# Altium project PCB.PrjPcb (part 6 of 8)

## Sheet FPGA_MISC.SchDoc
size 558 x 431 mm; SheetNumber: 8; SheetTotal: 25; Sheet_Name: FPGA MISCELLANEOUS; Size: 11x17
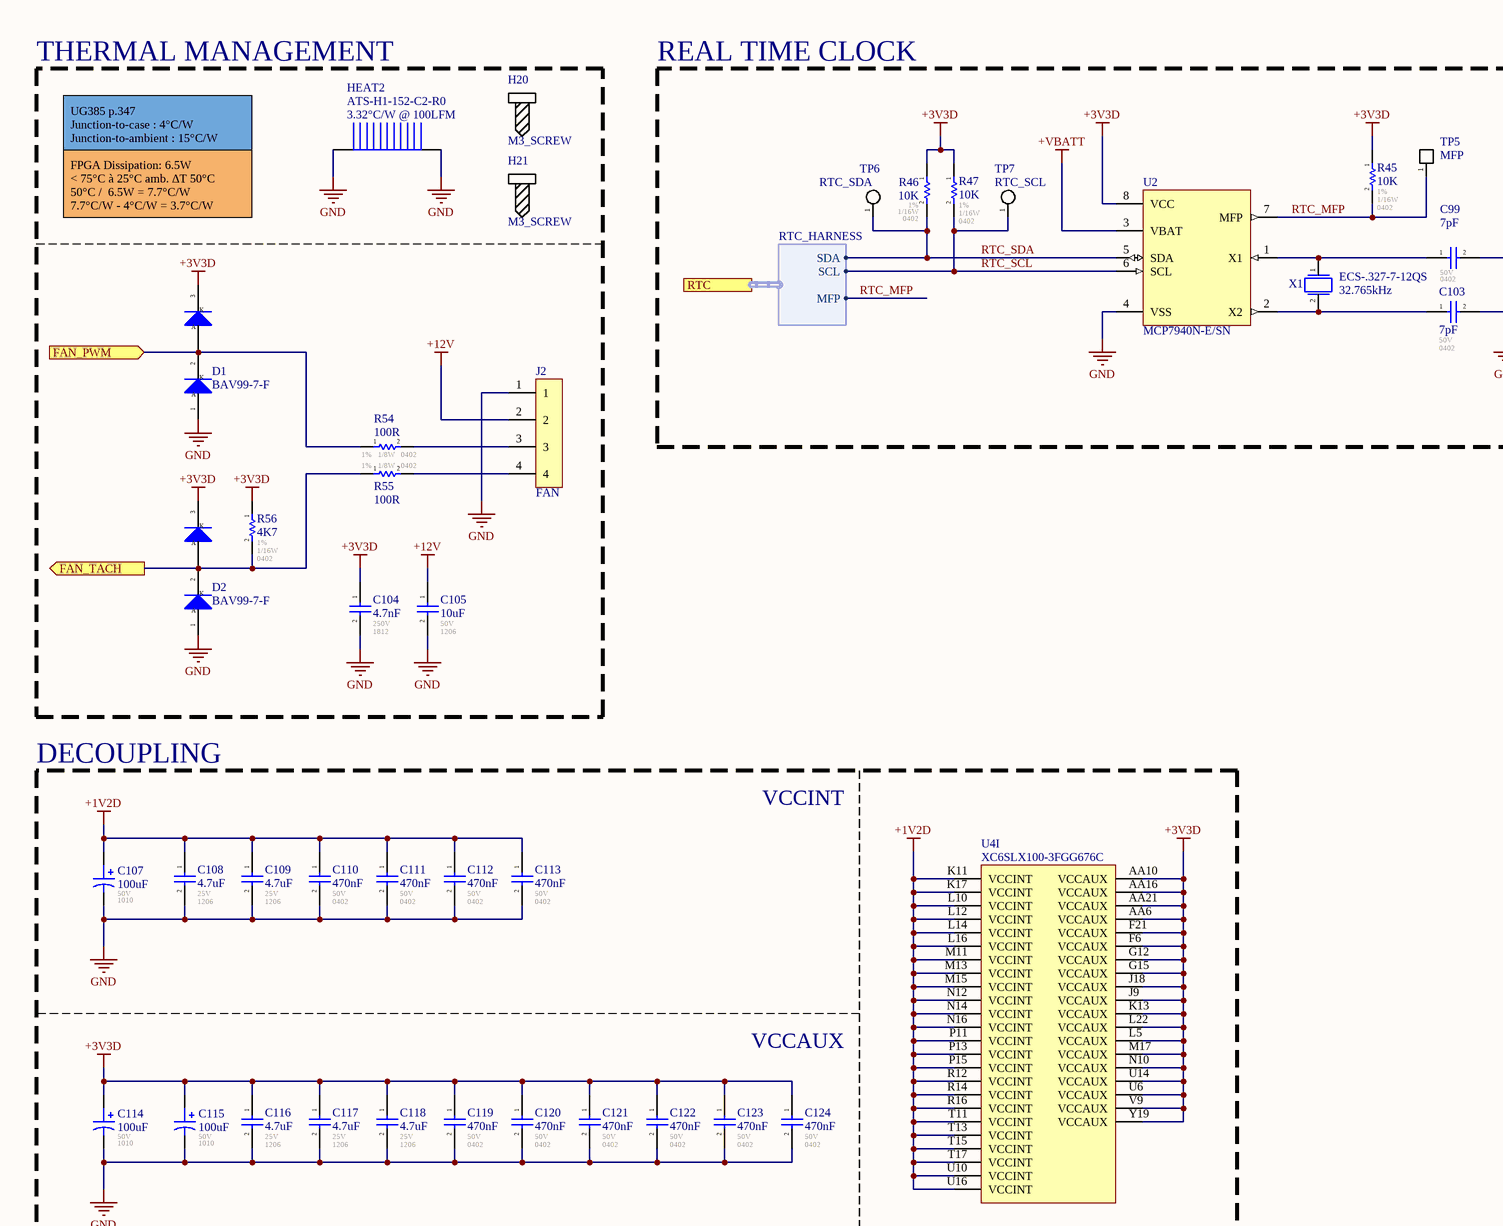
[diagram p32: FPGA_MISC.SchDoc, top left]
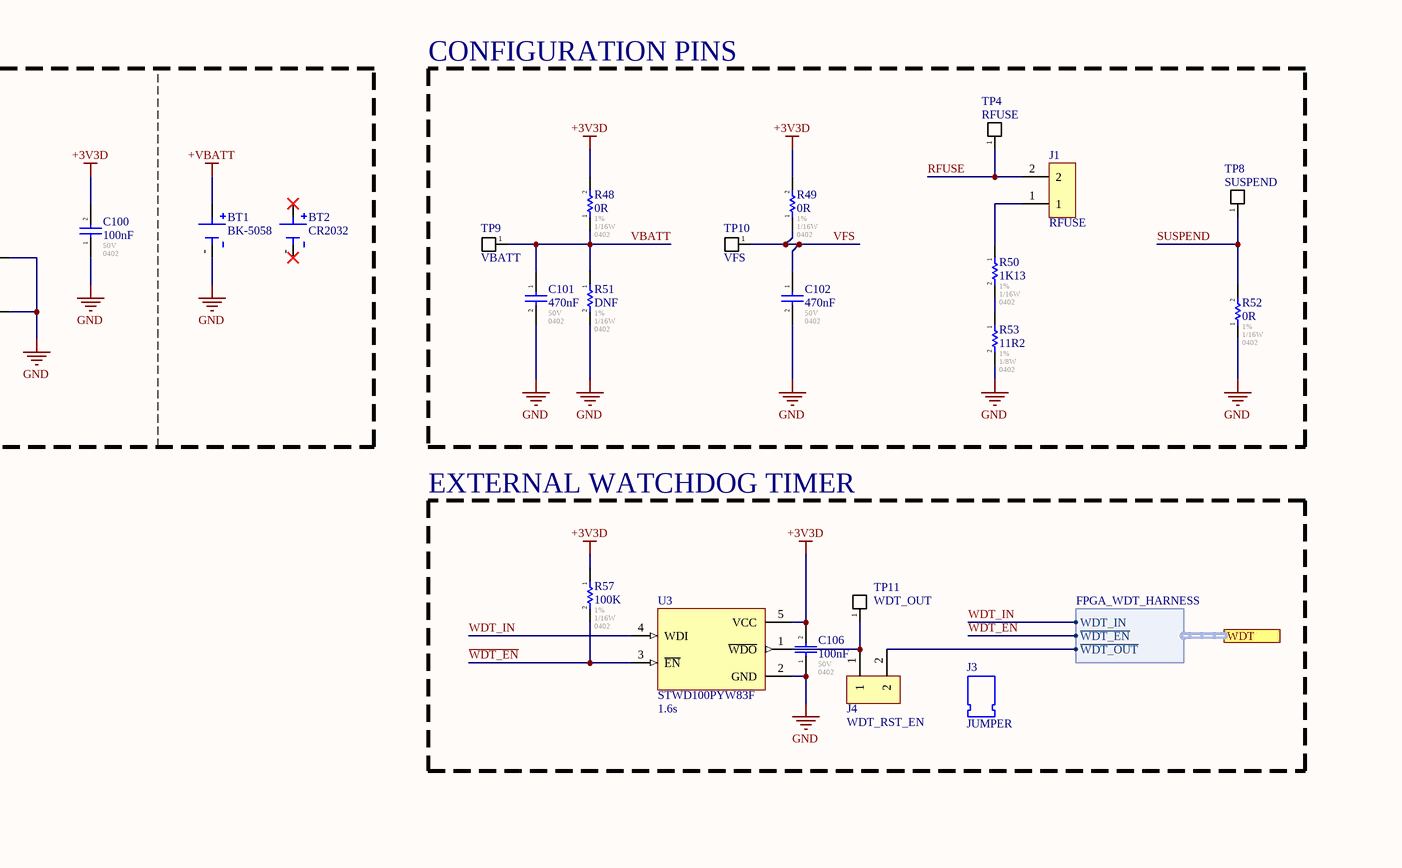
[diagram p33: FPGA_MISC.SchDoc, top right]
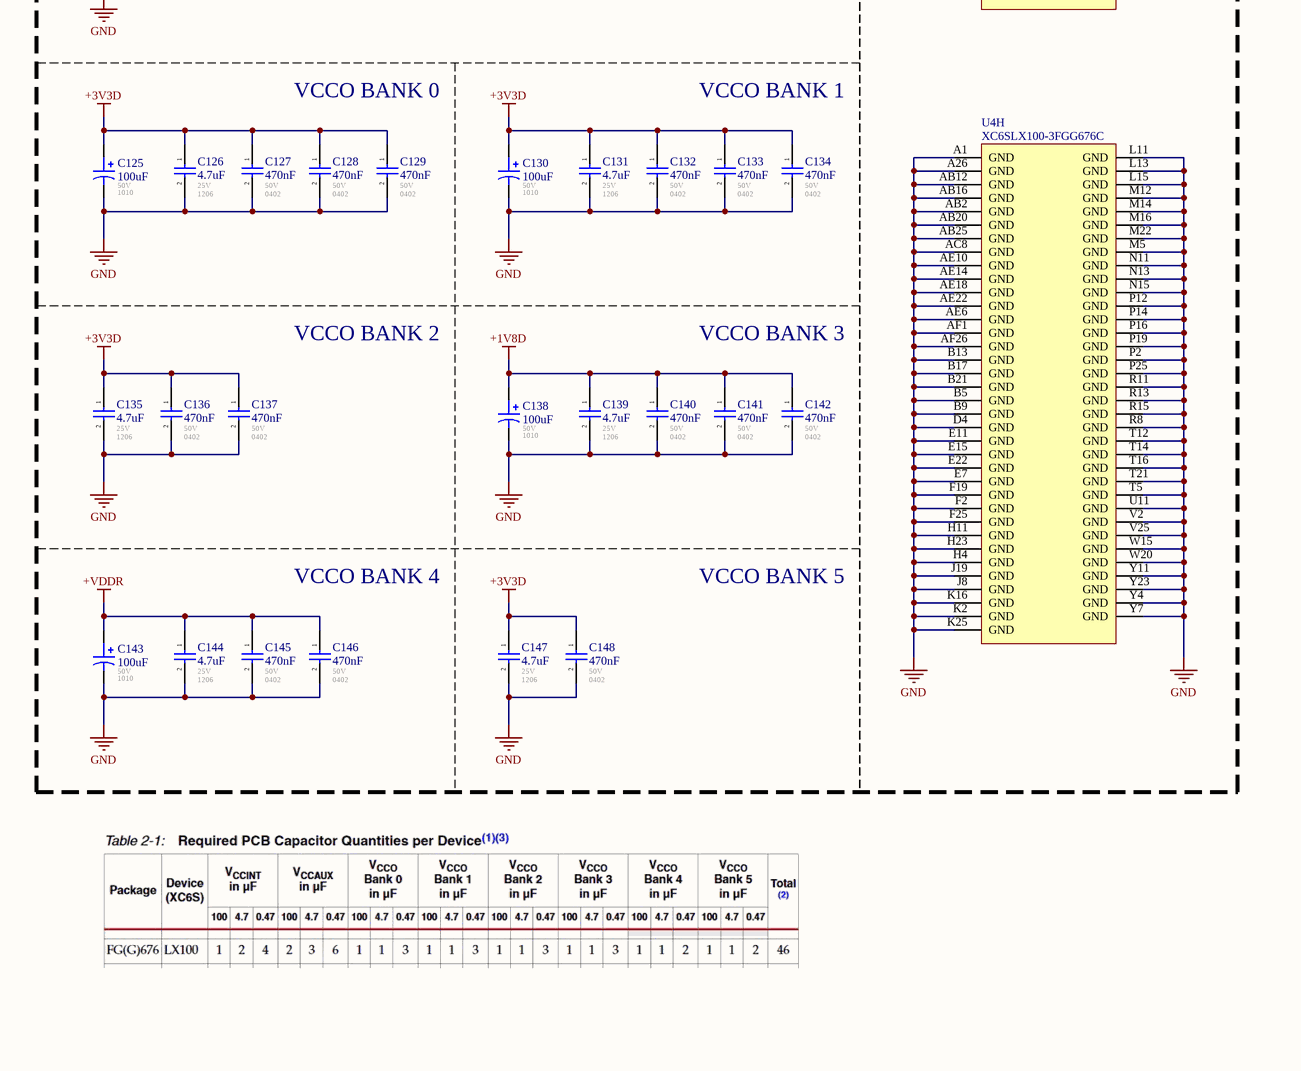
[diagram p34: FPGA_MISC.SchDoc, bottom left]
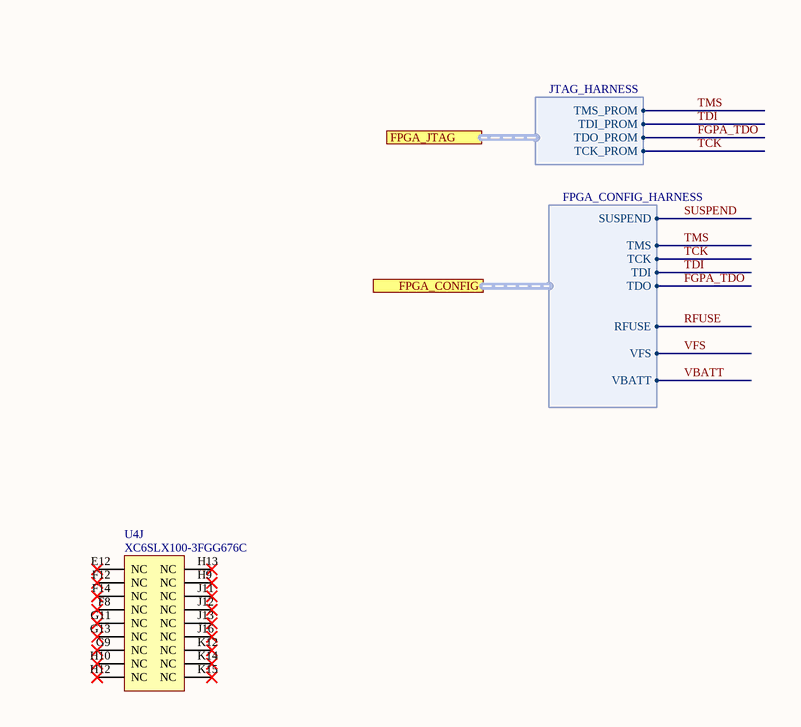
[diagram p35: FPGA_MISC.SchDoc, bottom right]

### Parts
BT1  BK-5058  [BK-5058]
BT2  CR2032  (mechanical)
C99  7pF  Voltage - Rated: 50V  Footprint: 0402  [CAP_0402]
C100  100nF  Voltage - Rated: 50V  Footprint: 0402  [CAP_0402]
C101  470nF  Voltage - Rated: 50V  Footprint: 0402  [CAP_0402]
C102  470nF  Voltage - Rated: 50V  Footprint: 0402  [CAP_0402]
C103  7pF  Voltage - Rated: 50V  Footprint: 0402  [CAP_0402]
C104  4.7nF  Voltage - Rated: 250V  Footprint: 1812  [CAP_1812]
C105  10uF  Voltage - Rated: 50V  Footprint: 1206  [CAP_1206]
C106  100nF  Voltage - Rated: 50V  Footprint: 0402  [CAP_0402]
C107  value 100uF  Voltage: 50V  Package: 1010  [CAP_ALU_1010_vishay]  (hidden comment: MAL215099101E3)
C108  4.7uF  Voltage - Rated: 25V  Footprint: 1206  [CAP_1206]
C109  4.7uF  Voltage - Rated: 25V  Footprint: 1206  [CAP_1206]
C110  470nF  Voltage - Rated: 50V  Footprint: 0402  [CAP_0402]
C111  470nF  Voltage - Rated: 50V  Footprint: 0402  [CAP_0402]
C112  470nF  Voltage - Rated: 50V  Footprint: 0402  [CAP_0402]
C113  470nF  Voltage - Rated: 50V  Footprint: 0402  [CAP_0402]
C114  value 100uF  Voltage: 50V  Package: 1010  [CAP_ALU_1010_vishay]  (hidden comment: MAL215099101E3)
C115  value 100uF  Voltage: 50V  Package: 1010  [CAP_ALU_1010_vishay]  (hidden comment: MAL215099101E3)
C116  4.7uF  Voltage - Rated: 25V  Footprint: 1206  [CAP_1206]
C117  4.7uF  Voltage - Rated: 25V  Footprint: 1206  [CAP_1206]
C118  4.7uF  Voltage - Rated: 25V  Footprint: 1206  [CAP_1206]
C119  470nF  Voltage - Rated: 50V  Footprint: 0402  [CAP_0402]
C120  470nF  Voltage - Rated: 50V  Footprint: 0402  [CAP_0402]
C121  470nF  Voltage - Rated: 50V  Footprint: 0402  [CAP_0402]
C122  470nF  Voltage - Rated: 50V  Footprint: 0402  [CAP_0402]
C123  470nF  Voltage - Rated: 50V  Footprint: 0402  [CAP_0402]
C124  470nF  Voltage - Rated: 50V  Footprint: 0402  [CAP_0402]
C125  value 100uF  Voltage: 50V  Package: 1010  [CAP_ALU_1010_vishay]  (hidden comment: MAL215099101E3)
C126  4.7uF  Voltage - Rated: 25V  Footprint: 1206  [CAP_1206]
C127  470nF  Voltage - Rated: 50V  Footprint: 0402  [CAP_0402]
C128  470nF  Voltage - Rated: 50V  Footprint: 0402  [CAP_0402]
C129  470nF  Voltage - Rated: 50V  Footprint: 0402  [CAP_0402]
C130  value 100uF  Voltage: 50V  Package: 1010  [CAP_ALU_1010_vishay]  (hidden comment: MAL215099101E3)
C131  4.7uF  Voltage - Rated: 25V  Footprint: 1206  [CAP_1206]
C132  470nF  Voltage - Rated: 50V  Footprint: 0402  [CAP_0402]
C133  470nF  Voltage - Rated: 50V  Footprint: 0402  [CAP_0402]
C134  470nF  Voltage - Rated: 50V  Footprint: 0402  [CAP_0402]
C135  4.7uF  Voltage - Rated: 25V  Footprint: 1206  [CAP_1206]
C136  470nF  Voltage - Rated: 50V  Footprint: 0402  [CAP_0402]
C137  470nF  Voltage - Rated: 50V  Footprint: 0402  [CAP_0402]
C138  value 100uF  Voltage: 50V  Package: 1010  [CAP_ALU_1010_vishay]  (hidden comment: MAL215099101E3)
C139  4.7uF  Voltage - Rated: 25V  Footprint: 1206  [CAP_1206]
C140  470nF  Voltage - Rated: 50V  Footprint: 0402  [CAP_0402]
C141  470nF  Voltage - Rated: 50V  Footprint: 0402  [CAP_0402]
C142  470nF  Voltage - Rated: 50V  Footprint: 0402  [CAP_0402]
C143  value 100uF  Voltage: 50V  Package: 1010  [CAP_ALU_1010_vishay]  (hidden comment: MAL215099101E3)
C144  4.7uF  Voltage - Rated: 25V  Footprint: 1206  [CAP_1206]
C145  470nF  Voltage - Rated: 50V  Footprint: 0402  [CAP_0402]
C146  470nF  Voltage - Rated: 50V  Footprint: 0402  [CAP_0402]
C147  4.7uF  Voltage - Rated: 25V  Footprint: 1206  [CAP_1206]
C148  470nF  Voltage - Rated: 50V  Footprint: 0402  [CAP_0402]
D1  BAV99-7-F  [SOT23-3]
D2  BAV99-7-F  [SOT23-3]
H20  M3_SCREW  (mechanical)
H21  M3_SCREW  (mechanical)
HEAT2  ATS-H1-152-C2-R0  Thermal Resistance: 3.32°C/W @ 100LFM  [ATS-H1-152-C2-R0]
J1  RFUSE  [HEADER-2_100MIL]
J2  FAN  [FAN_HEADER-4]
J3  JUMPER  (mechanical)
J4  WDT_RST_EN  [HEADER-2_100MIL]
R45  10K  Tolerance: 1%  Power: 1/16W  Package / Case: 0402  [RES_0402]
R46  10K  Tolerance: 1%  Power: 1/16W  Package / Case: 0402  [RES_0402]
R47  10K  Tolerance: 1%  Power: 1/16W  Package / Case: 0402  [RES_0402]
R48  0R  Tolerance: 1%  Power: 1/16W  Package / Case: 0402  [RES_0402]
R49  0R  Tolerance: 1%  Power: 1/16W  Package / Case: 0402  [RES_0402]
R50  1K13  Tolerance: 1%  Power: 1/16W  Package / Case: 0402  [RES_0402]
R51  DNF  Tolerance: 1%  Power: 1/16W  Package / Case: 0402  [RES_0402]
R52  0R  Tolerance: 1%  Power: 1/16W  Package / Case: 0402  [RES_0402]
R53  11R2  Tolerance: 1%  Power: 1/8W  Package / Case: 0402  [RES_0402]
R54  100R  Tolerance: 1%  Power: 1/8W  Package / Case: 0402  [RES_0402]
R55  100R  Tolerance: 1%  Power: 1/8W  Package / Case: 0402  [RES_0402]
R56  4K7  Tolerance: 1%  Power: 1/16W  Package / Case: 0402  [RES_0402]
R57  100K  Tolerance: 1%  Power: 1/16W  Package / Case: 0402  [RES_0402]
TP4  RFUSE  [TP_PAD]  (no BOM)
TP5  MFP  [TP_PAD]  (no BOM)
TP6  RTC_SDA  [TP_PAD_SMALL]  (no BOM)
TP7  RTC_SCL  [TP_PAD_SMALL]  (no BOM)
TP8  SUSPEND  [TP_PAD]  (no BOM)
TP9  VBATT  [TP_PAD]  (no BOM)
TP10  VFS  [TP_PAD]  (no BOM)
TP11  WDT_OUT  [TP_PAD]  (no BOM)
U2  MCP7940N-E/SN  [SOIC-8_3.8mm]
U3  STWD100PYW83F  Reset Timeout: 1.6s  [SOT23-5]
U4  XC6SLX100-3FGG676C  [FPGA_XILINX_FGG676]  (parts H,I,J of 10)
X1  ECS-.327-7-12QS  Frequency: 32.765kHz  [ECX-12Q-2MMx1.2MM]

### Blocks framed on the sheet
THERMAL MANAGEMENT: C104 C105 D1 D2 H20 H21 HEAT2 J2 R54-R56
REAL TIME CLOCK: BT1 BT2 C99 C100 C103 R45-R47 TP5-TP7 U2 X1
CONFIGURATION PINS: C101 C102 J1 R48-R53 TP4 TP8-TP10
EXTERNAL WATCHDOG TIMER: C106 J3 J4 R57 TP11 U3
DECOUPLING: C107-C148 U4

### Ports
FAN_PWM (in), FAN_TACH (out), FPGA_CONFIG (harness FPGA_CONFIG_HARNESS), FPGA_JTAG (harness JTAG_HARNESS), RTC (harness RTC_HARNESS), WDT (harness FPGA_WDT_HARNESS)

### Harnesses
FPGA_CONFIG_HARNESS: TCK, TDO, TDI, SUSPEND, TMS, RFUSE, VFS, VBATT
FPGA_WDT_HARNESS: WDT_IN, ~{WDT_EN}, ~{WDT_OUT}
JTAG_HARNESS: TCK_PROM, TDO_PROM, TDI_PROM, TMS_PROM
RTC_HARNESS: SDA, SCL, MFP

### Nets
+1V2D: C107.1 C108.1 C109.1 C110.1 C111.1 C112.1 C113.1 U4.K11(VCCINT) U4.K17(VCCINT) U4.L10(VCCINT) U4.L12(VCCINT) U4.L14(VCCINT) U4.L16(VCCINT) U4.M11(VCCINT) U4.M13(VCCINT) U4.M15(VCCINT) U4.N12(VCCINT) U4.N14(VCCINT) U4.N16(VCCINT) U4.P11(VCCINT) U4.P13(VCCINT) U4.P15(VCCINT) U4.R12(VCCINT) U4.R14(VCCINT) U4.R16(VCCINT) U4.T11(VCCINT) U4.T13(VCCINT) U4.T15(VCCINT) U4.T17(VCCINT) U4.U10(VCCINT) U4.U16(VCCINT)
+1V8D: C138.1 C139.1 C140.1 C141.1 C142.1
+3V3D: C100.2 C104.1 C106.2 C114.1 C115.1 C116.1 C117.1 C118.1 C119.1 C120.1 C121.1 C122.1 C123.1 C124.1 C125.1 C126.1 C127.1 C128.1 C129.1 C130.1 C131.1 C132.1 C133.1 C134.1 C135.1 C136.1 C137.1 C147.1 C148.1 D1.3(K) D2.3(K) R45.1 R46.1 R47.1 R48.2 R49.2 R56.1 R57.1 U2.8(VCC) U3.5(VCC) U4.AA6(VCCAUX) U4.AA10(VCCAUX) U4.AA16(VCCAUX) U4.AA21(VCCAUX) U4.F6(VCCAUX) U4.F21(VCCAUX) U4.G12(VCCAUX) U4.G15(VCCAUX) U4.J9(VCCAUX) U4.J18(VCCAUX) U4.K13(VCCAUX) U4.L5(VCCAUX) U4.L22(VCCAUX) U4.M17(VCCAUX) U4.N10(VCCAUX) U4.U6(VCCAUX) U4.U14(VCCAUX) U4.V9(VCCAUX) U4.Y19(VCCAUX)
+12V: C105.1 J2.2
+VBATT: BT1.+ U2.3(VBAT)
+VDDR: C143.1 C144.1 C145.1 C146.1
GND: BT1.- C99.2 C100.1 C101.2 C102.2 C103.2 C104.2 C105.2 C106.1 C107.2 C108.2 C109.2 C110.2 C111.2 C112.2 C113.2 C114.2 C115.2 C116.2 C117.2 C118.2 C119.2 C120.2 C121.2 C122.2 C123.2 C124.2 C125.2 C126.2 C127.2 C128.2 C129.2 C130.2 C131.2 C132.2 C133.2 C134.2 C135.2 C136.2 C137.2 C138.2 C139.2 C140.2 C141.2 C142.2 C143.2 C144.2 C145.2 C146.2 C147.2 C148.2 D1.1(A) D2.1(A) HEAT2.1 HEAT2.2 J2.1 R51.2 R52.1 R53.2 U2.4(VSS) U3.2(GND) U4.A1(GND) U4.A26(GND) U4.AB2(GND) U4.AB12(GND) U4.AB16(GND) U4.AB20(GND) U4.AB25(GND) U4.AC8(GND) U4.AE6(GND) U4.AE10(GND) U4.AE14(GND) U4.AE18(GND) U4.AE22(GND) U4.AF1(GND) U4.AF26(GND) U4.B5(GND) U4.B9(GND) U4.B13(GND) U4.B17(GND) U4.B21(GND) U4.D4(GND) U4.E7(GND) U4.E11(GND) U4.E15(GND) U4.E22(GND) U4.F2(GND) U4.F19(GND) U4.F25(GND) U4.H4(GND) U4.H11(GND) U4.H23(GND) U4.J8(GND) U4.J19(GND) U4.K2(GND) U4.K16(GND) U4.K25(GND) U4.L11(GND) U4.L13(GND) U4.L15(GND) U4.M5(GND) U4.M12(GND) U4.M14(GND) U4.M16(GND) U4.M22(GND) U4.N11(GND) U4.N13(GND) U4.N15(GND) U4.P2(GND) U4.P12(GND) U4.P14(GND) U4.P16(GND) U4.P19(GND) U4.P25(GND) U4.R8(GND) U4.R11(GND) U4.R13(GND) U4.R15(GND) U4.T5(GND) U4.T12(GND) U4.T14(GND) U4.T16(GND) U4.T21(GND) U4.U11(GND) U4.V2(GND) U4.V25(GND) U4.W15(GND) U4.W20(GND) U4.Y4(GND) U4.Y7(GND) U4.Y11(GND) U4.Y23(GND)
~{WDT_EN}: R57.2 U3.3(~{EN}) ; port WDT.~{WDT_EN}
FAN_PWM: D1.2(K) R54.1 ; port FAN_PWM
FAN_TACH: D2.2(K) R55.1 R56.2 ; port FAN_TACH
FGPA_TDO: port FPGA_CONFIG.TDO, port FPGA_JTAG.TDO_PROM
RFUSE: J1.2 TP4.1(A) ; port FPGA_CONFIG.RFUSE
RTC_MFP: R45.2 TP5.1(A) U2.7(MFP) ; port RTC.MFP
RTC_SCL: R47.2 TP7.1(A) U2.6(SCL) ; port RTC.SCL
RTC_SDA: R46.2 TP6.1(A) U2.5(SDA) ; port RTC.SDA
SUSPEND: R52.2 TP8.1(A) ; port FPGA_CONFIG.SUSPEND
TCK: port FPGA_CONFIG.TCK, port FPGA_JTAG.TCK_PROM
TDI: port FPGA_CONFIG.TDI, port FPGA_JTAG.TDI_PROM
TMS: port FPGA_CONFIG.TMS, port FPGA_JTAG.TMS_PROM
VBATT: C101.1 R48.1 R51.1 TP9.1(A) ; port FPGA_CONFIG.VBATT
VFS: C102.1 R49.1 TP10.1(A) ; port FPGA_CONFIG.VFS
WDT_IN: U3.4(WDI) ; port WDT.WDT_IN
WDTO: J4.2 ; port WDT.~{WDT_OUT}
NetC99_1: C99.1 U2.1(X1) X1.1
NetC103_1: C103.1 U2.2(X2) X1.2
NetJ1_1: J1.1 R50.1
NetJ2_3: J2.3 R54.2
NetJ2_4: J2.4 R55.2
NetJ4_1: J4.1 TP11.1(A) U3.1(~{WDO})
NetR50_2: R50.2 R53.1

Not connected (* = marked no-connect by the designer): BT2 +* -*; U4 E12(NC)* F8(NC)* F12(NC)* F14(NC)* G9(NC)* G11(NC)* G13(NC)* H9(NC)* H10(NC)* H12(NC)* H13(NC)* J11(NC)* J12(NC)* J13(NC)* J16(NC)* K12(NC)* K14(NC)* K15(NC)*

### Notes on the sheet
- UG385 p.347
  Junction-to-case : 4°C/W
  Junction-to-ambient : 15°C/W
- FPGA Dissipation: 6.5W
  < 75°C à 25°C amb. ΔT 50°C
  50°C /  6.5W = 7.7°C/W
  7.7°C/W - 4°C/W = 3.7°C/W
- VCCINT
- VCCAUX
- VCCO BANK 0
- VCCO BANK 1
- VCCO BANK 2
- VCCO BANK 3
- VCCO BANK 4
- VCCO BANK 5
- Sheet Name
- Project Title
- Global Project
- Revision
- Size
- Date
- Group
- Sheet
- of
- Filename
- Designers

### Library data of the parts
BT1 = BATTERY: Battery Holder; Mfr: MPD; ComponentLink1Description: Digikey; ComponentLink1URL: https://www.digikey.com/en/products/detail/mpd-memory-protection-devices/BK-5058/2194769
BT2 = BATTERY: Mfr: *; Size: *; Capacity: *; Voltage - Max: *; Voltage - Nominal: *; Voltage - Min: *; Current - Max: *
C99 C103 = CAP_CER: 0402 7pF C0G Ceramic Capacitor / GCM1555C1H7R0BA16D; Mfr: Murata; Operating Temperature: -55C - 125C; Temperature Coefficient: C0G; ComponentLink1Description: Digikey; ComponentLink1URL: https://www.digikey.ca/en/products/detail/murata-electronics/GCM1555C1H7R0BA16D/11618476; ComponentLink2Description: Datasheet; ComponentLink2URL: https://search.murata.co.jp/Ceramy/image/img/A01X/G101/ENG/GCM1555C1H7R0BA16-01.pdf
C100 C106 = CAP_CER: GCM155R71H104KE02J / 0402 100nF 10% X7R Ceramic Capacitor; Mfr: Murata; Operating Temperature: -55C - 125C; Temperature Coefficient: X7R; ComponentLink1Description: Digikey; ComponentLink1URL: [Digikey Link]; Part#: GCM155R71H104KE02J; ComponentLink2Description: Datasheet; ComponentLink2URL: [Datasheet Link]; Tolerance: 10%; Ratings: AEC-Q200
C101 C102 C110-C113 C119-C124 C127-C129 C132-C134 C136 C137 C140-C142 C145 C146 C148 = CAP_CER: CGA3E3X7R1H474K080AB / 0603 470nF 10% X7R Ceramic Capacitor; Mfr: TDK; Operating Temperature: -55C - 125C; Temperature Coefficient: X7R; ComponentLink1Description: Digikey; ComponentLink1URL: [Digikey Link]; Part#: CGA3E3X7R1H474K080AB; ComponentLink2Description: Datasheet; ComponentLink2URL: [Datasheet Link]; Tolerance: 10%; Ratings: AEC-Q200
C104 = CAP_CER: GA343DR7GD472KW01L / 0402 4.7nF 10% X7R 1812 250VAC Ceramic Capacitor; Mfr: Murata; Ratings: Y3 - Safety; Operating Temperature: -55C - 125C; Temperature Coefficient: X7R; ComponentLink1Description: Digikey; ComponentLink1URL: https://www.digikey.ca/en/products/detail/murata-electronics/GA343DR7GD472KW01L/789292; ComponentLink2Description: Datasheet; ComponentLink2URL: https://search.murata.co.jp/Ceramy/image/img/A01X/G101/ENG/GA343DR7GD472KW01-01.pdf; ComponentLink3Description: Octopart; ComponentLink3URL: https://octopart.com/ga343dr7gd472kw01l-murata-197048?r=sp; Tolerance: 10%; Part#: GA343DR7GD472KW01L; ComponentLink4Description: Murata; ComponentLink4URL: https://www.murata.com/en-us/products/productdetail?partno=GA343DR7GD472KW01%23
C105 = CAP_CER: GRT31CR61H106KE01L / 1206 10uF 10% X5R Ceramic Capacitor; Mfr: Murata; Operating Temperature: -55C - 85C; Temperature Coefficient: X5R; ComponentLink1Description: Digikey; ComponentLink1URL: [Digikey Link]; ComponentLink2Description: Datasheet; ComponentLink2URL: [Datasheet Link]; Tolerance: 10%; Ratings: AEC-Q200; Supplier 1: Arrow Electronics; Supplier Part Number 1: GRT31CR61H106KE01L; Part#: GRT31CR61H106KE01L
C107 C114 C115 C125 C130 C138 C143 = CAP_ALU_MAL215099101E3: CAP - ALU 100uF 20% 50V - 1010; Current: 490mA; Mfg: Vishay Dale; Mfg Part Number: MAL215099101E3; HelpURL: http://www.vishay.com/docs/28395/150crz.pdf; CreatedBy: Jonathan Bouchard; Temperature: -55°C to 125°C; Power: *; Supplier 1: Digikey; Supplier Part Number 1: 4399PHDKR-ND; Precision: 20%
C108 C109 C116-C118 C126 C131 C135 C139 C144 C147 = CAP_CER: CGA8L2X7R1E475M160KA / 1812 4.7uF 20% X7R Ceramic Capacitor; Mfr: TDK; Part#: CGA9N1X7R1V476M230KC; Operating Temperature: -55C - 125C; Temperature Coefficient: X7R; ComponentLink1Description: Digikey; ComponentLink1URL: https://www.digikey.ca/en/products/detail/tdk-corporation/CGA9N1X7R1V476M230KC/15930202; ComponentLink2Description: Datasheet; ComponentLink2URL: https://product.tdk.com/system/files/dam/doc/product/capacitor/ceramic/mlcc/catalog/mlcc_automotive_general_en.pdf; Tolerance: 20%; Ratings: AEC-Q200; ComponentLink3Description: TDK; ComponentLink3URL: https://product.tdk.com/en/search/capacitor/ceramic/mlcc/info?part_no=CGA9N1X7R1V476M230KC; ComponentLink4Description: Octopart; ComponentLink4URL: https://octopart.com/cga9n1x7r1v476m230kc-tdk-122377816?r=sp; Supplier 1: Newark; Supplier Part Number 1: 57AK9414
D1 D2 = DIODE_TVS_DUAL: Diode Array 1 Pair Series Connection 75 V 300mA (DC) Surface Mount TO-236-3, SC-59, SOT-23-3; Mfr: Diodes Incorporated; Voltage - DC Reverse: 75V; Voltage - Forward: 1.25V @ 150mA; Reverse Recovery Time: 4ns; Capacitance: 2pF; Current - Reverse Leakage: 2.5µA @ 75V; Operating Temperature: -65C - 150C; Package / Case: SOT-23-3; Current: 300mA; ComponentLink1Description: Digikey; ComponentLink1URL: https://www.digikey.ca/en/products/detail/diodes-incorporated/BAV99-7-F/815018; ComponentLink2Description: Datasheet; ComponentLink2URL: https://www.diodes.com/assets/Datasheets/BAV99.pdf; ComponentLink3Description: Octopart; ComponentLink3URL: https://octopart.com/bav99-7-f-diodes+inc.-326328; Supplier 1: Future Electronics; Supplier Part Number 1: 3851920
HEAT2 = HEATSINK_ATS-H1-152-C2-R0: Heatsink Aluminium; Mfr: Advanced Thermal Solutions Inc.; Hole Size: 3mm; Hole-to-hole: 56,5685mm; Fin Height: 35mm; Length: 35; Width: 35; Material: Aluminium; ComponentLink1Description: Digikey; ComponentLink1URL: https://www.digikey.com/en/products/detail/advanced-thermal-solutions-inc/ATS-H1-152-C2-R0/4624447; Supplier 1: Digikey; Supplier Part Number 1: ATS36354-ND; ComponentLink2Description: Mfr; ComponentLink2URL: https://www.qats.com/Online-PushPin/ATS-H1-152-C2-R0
J1 J4 = HEADER_2
J2 = HEADER_4
R45-R57 = RESISTOR: Automotive: AEC-Q200; Operating Temperature: *; # Digikey: *; ComponentLink1Description: Digikey; ComponentLink1URL: *; # Manufacturer: *
TP4 TP5 TP8-TP11 = TESTPOINT_PAD: Test Point
TP6 TP7 = TESTPOINT_PAD_SMALL: Test Point
U2 = MCP7940N-E/SN: Real Time Clock (RTC) IC Clock/Calendar 64B I2C, 2-Wire Serial 8-SOIC (0.154", 3.90mm Width); Mfr: Microchip; Qualification: AEC-Q100; Voltage - Suply: 1.8V - 5.5V; Voltage - Battery: 1.3V - 5.5V; Clock Speed: 32.768kHz; Operating Temperature: -40C - 125C; ComponentLink1Description: Digikey; ComponentLink1URL: https://www.digikey.ca/en/products/detail/microchip-technology/MCP7940N-E-SN/3872278; ComponentLink2Description: Datasheet; ComponentLink2URL: https://ww1.microchip.com/downloads/aemDocuments/documents/MPD/ProductDocuments/DataSheets/MCP7940N-Battery-Backed-I2C-RTCC-with-SRAM-20005010J.pdf; ComponentLink3Description: Mfr; ComponentLink3URL: https://www.microchip.com/en-us/product/MCP7940N; ComponentLink4Description: Octopart; ComponentLink4URL: https://octopart.com/mcp7940n-e%2Fsn-microchip-24995176?r=sp
U3 = STWD100PYW83F: WATCHDOG CIRCUIT / IC SUPERVISOR 1 CHANNEL SOT23-5; Mfr: ST; Qualification: AEC-Q100; ComponentLink1Description: Digikey; ComponentLink1URL: https://www.digikey.ca/en/products/detail/stmicroelectronics/STWD100PYW83F/3711383; ComponentLink2Description: Datasheet; ComponentLink2URL: https://www.st.com/content/ccc/resource/technical/document/datasheet/06/6a/b3/83/9a/c7/4f/22/CD00176077.pdf/files/CD00176077.pdf/jcr:content/translations/en.CD00176077.pdf; Supplier 1: Mouser; Supplier Part Number 1: 511-STWD100PYW83F
U4 = FPGA_XC6SLX100-3FGG676C: FPGA - XILINX SPARTAN 6 480 I/O - BGA-676; Voltage: 1.14 V ~ 1.26 V; Current: *; Power: *; Mfg: Xilinx; Mfg Part Number: XC6SLX100-3FGG676C; HelpURL: https://www.xilinx.com/support/documentation/data_sheets/ds162.pdf; CreatedBy: Jonathan Bouchard; Temperature: 0°C ~ 85°C (TJ); Value: *; Precision: *; Package: BGA-676; Supplier 1: Digikey; Supplier Part Number 1: 122-1760-ND
X1 = OSCILLATOR: 25 MHz ±30ppm Crystal 16pF 40 Ohms HC-49/US; Frequency Tolerance: 20ppm; Load Capacitance: 7pF; Operating Temperature: -40C - 125C; Rating: AEC-Q200; Type: Tuning Fork; ComponentLink1Description: Digikey; ComponentLink1URL: https://www.digikey.ca/en/products/detail/ecs-inc/ECS-327-7-12QS-TR/6821607; ComponentLink2Description: Datasheet; ComponentLink2URL: https://ecsxtal.com/store/pdf/ECX-12Q.pdf; Supplier Part Number 1: 94X0915

## Sheet FPGA_IO.SchDoc
size 863 x 558 mm; SheetNumber: 9; SheetTotal: 25; Sheet_Name: FPGA IO BANKS; Size: 11x17
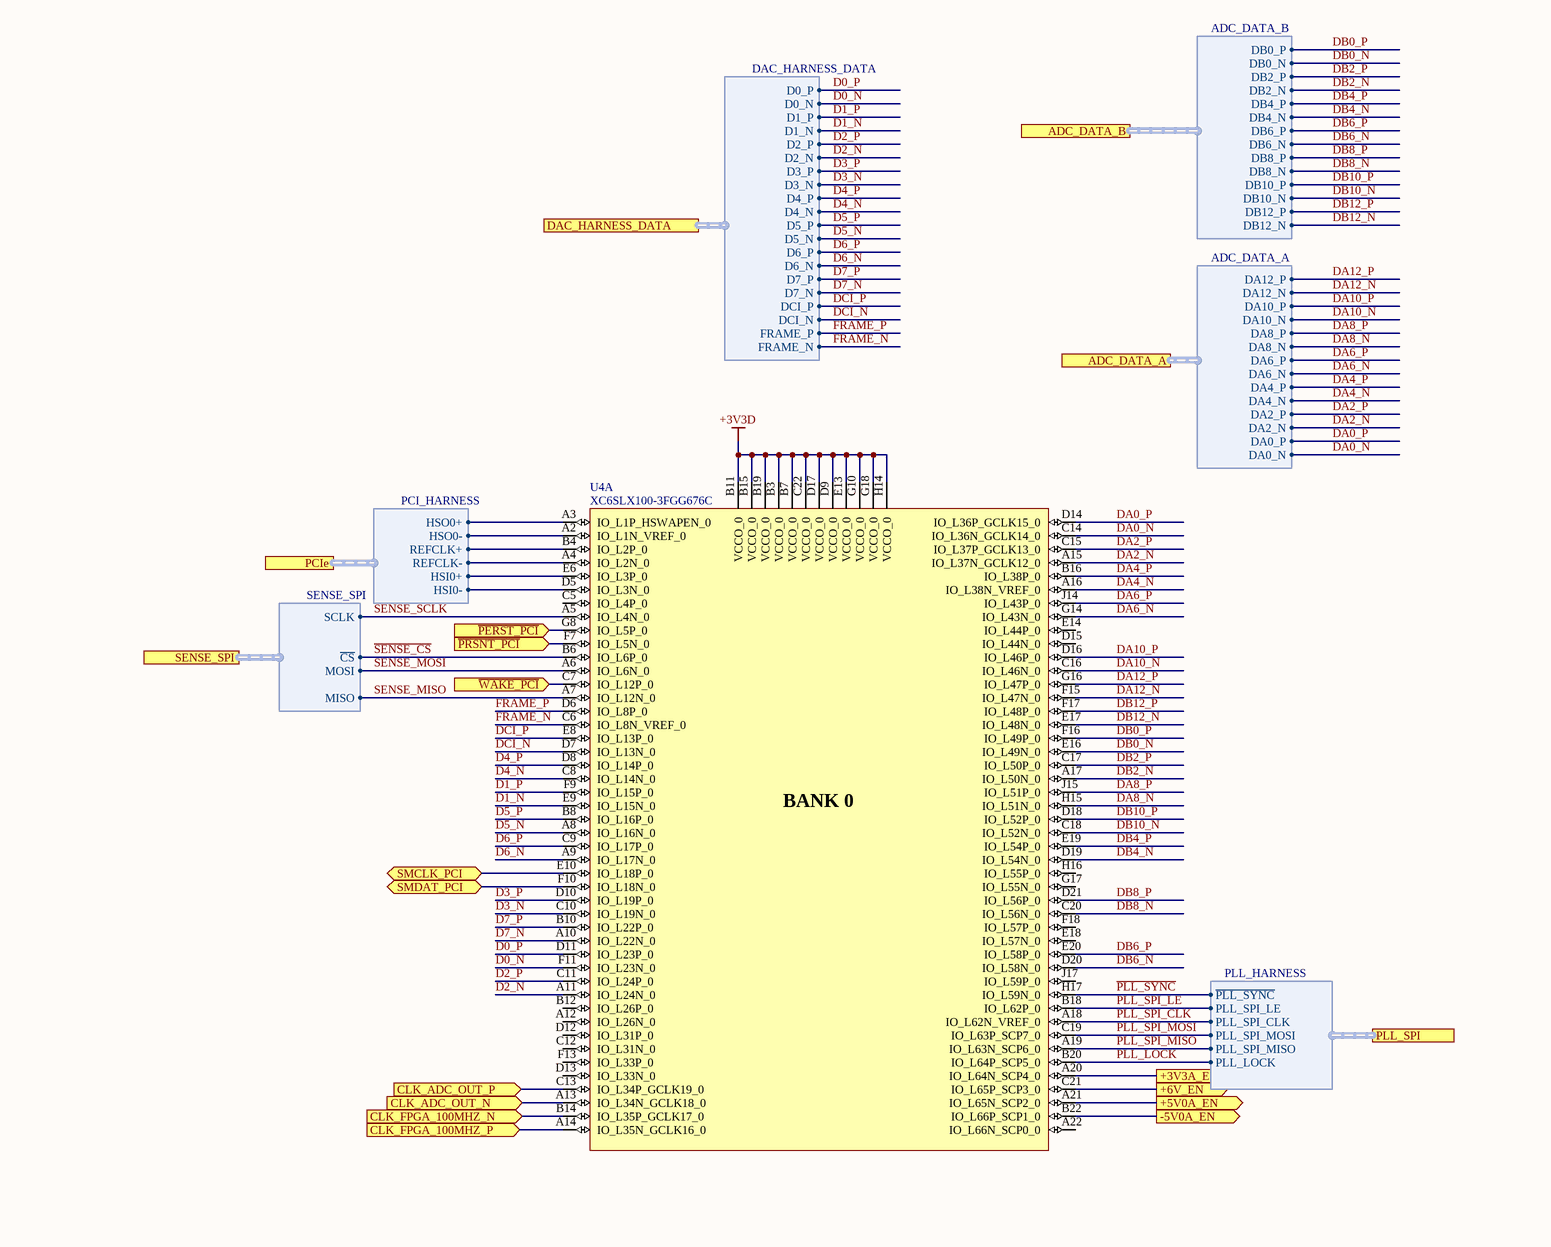
[diagram p36: FPGA_IO.SchDoc, top left]
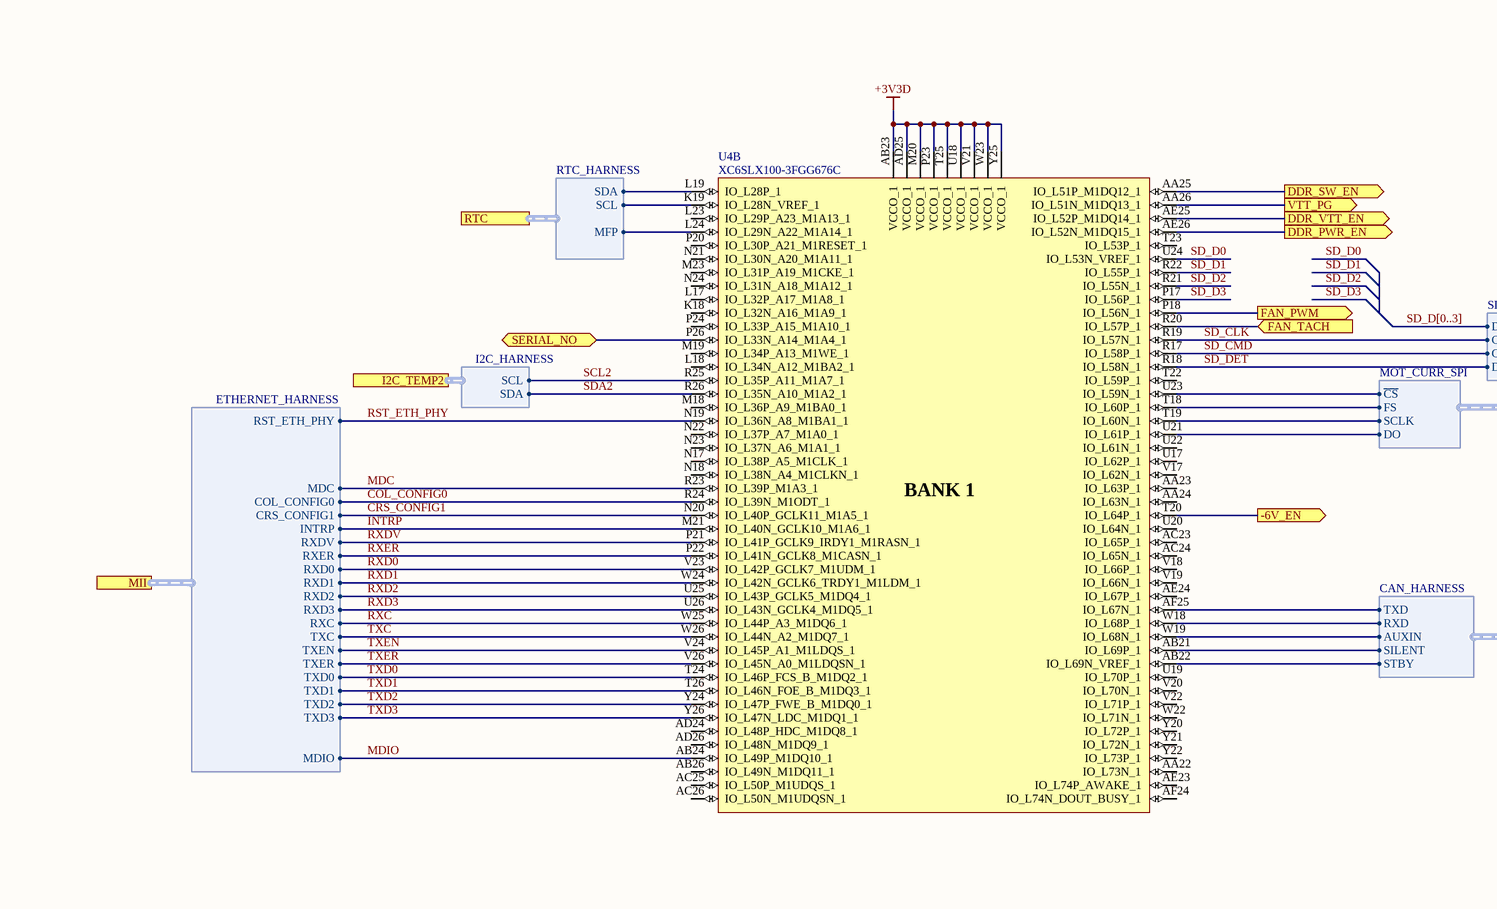
[diagram p37: FPGA_IO.SchDoc, top middle]
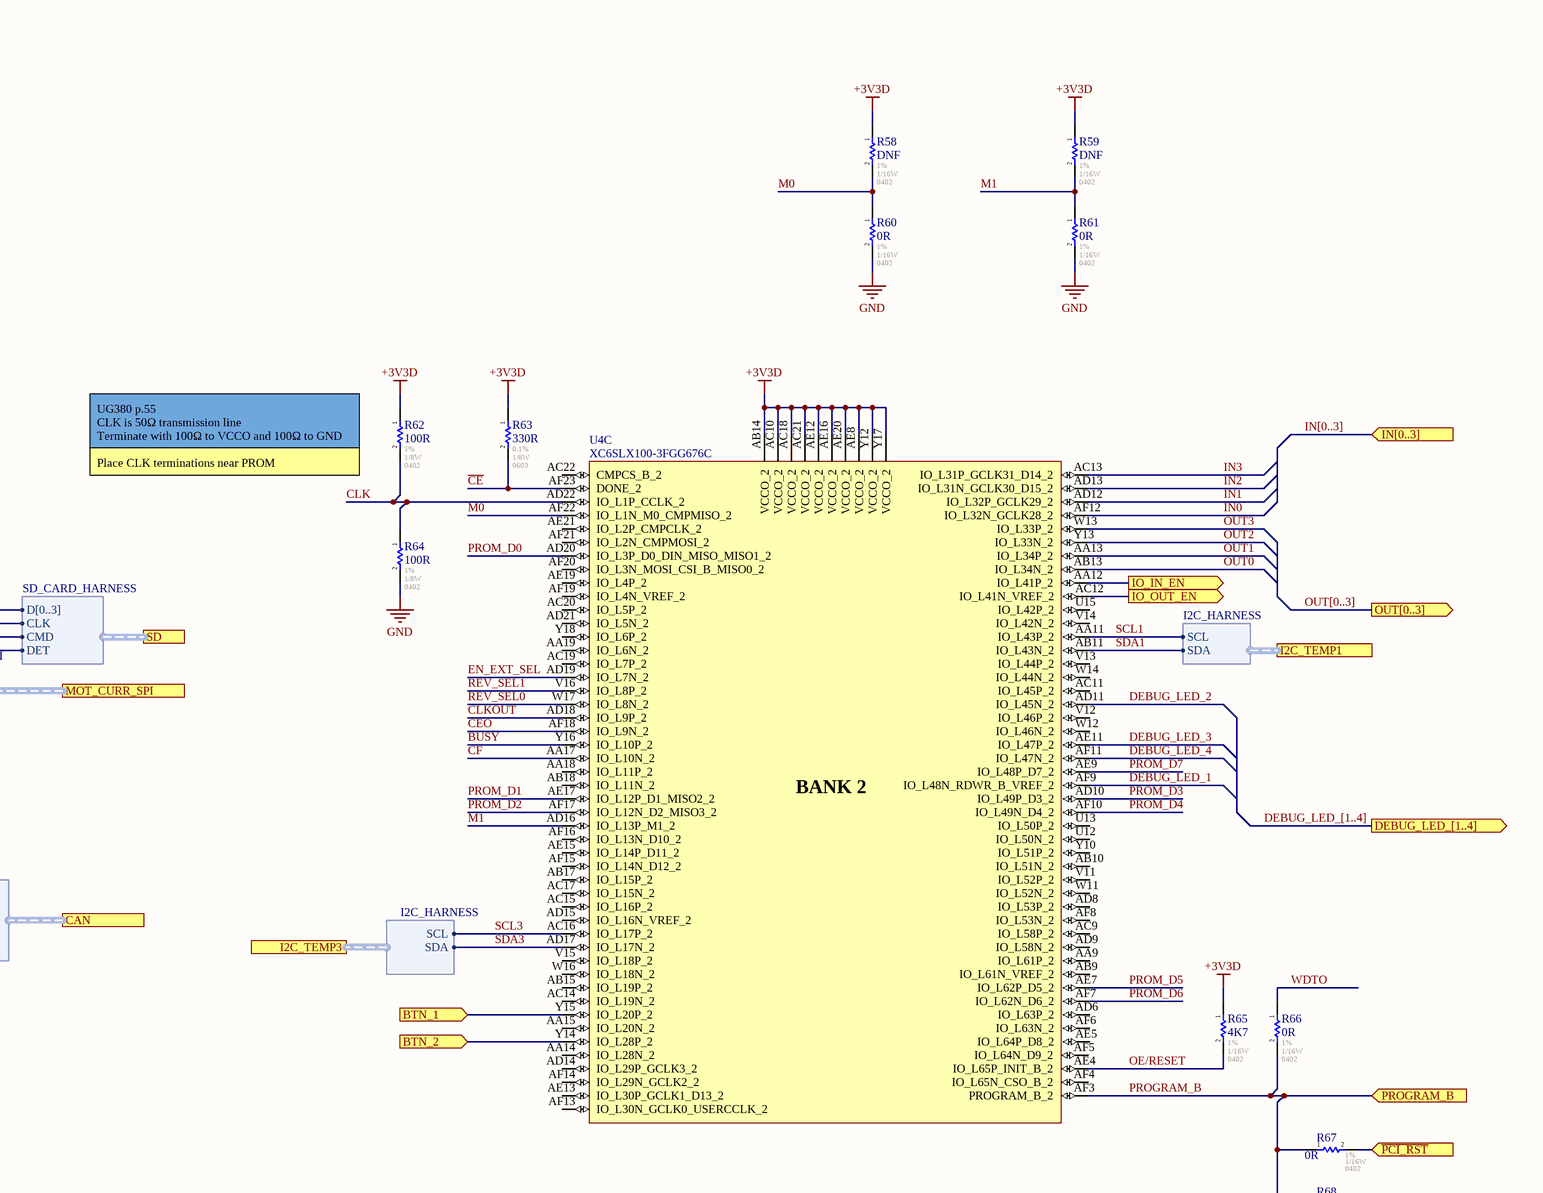
[diagram p38: FPGA_IO.SchDoc, top right]
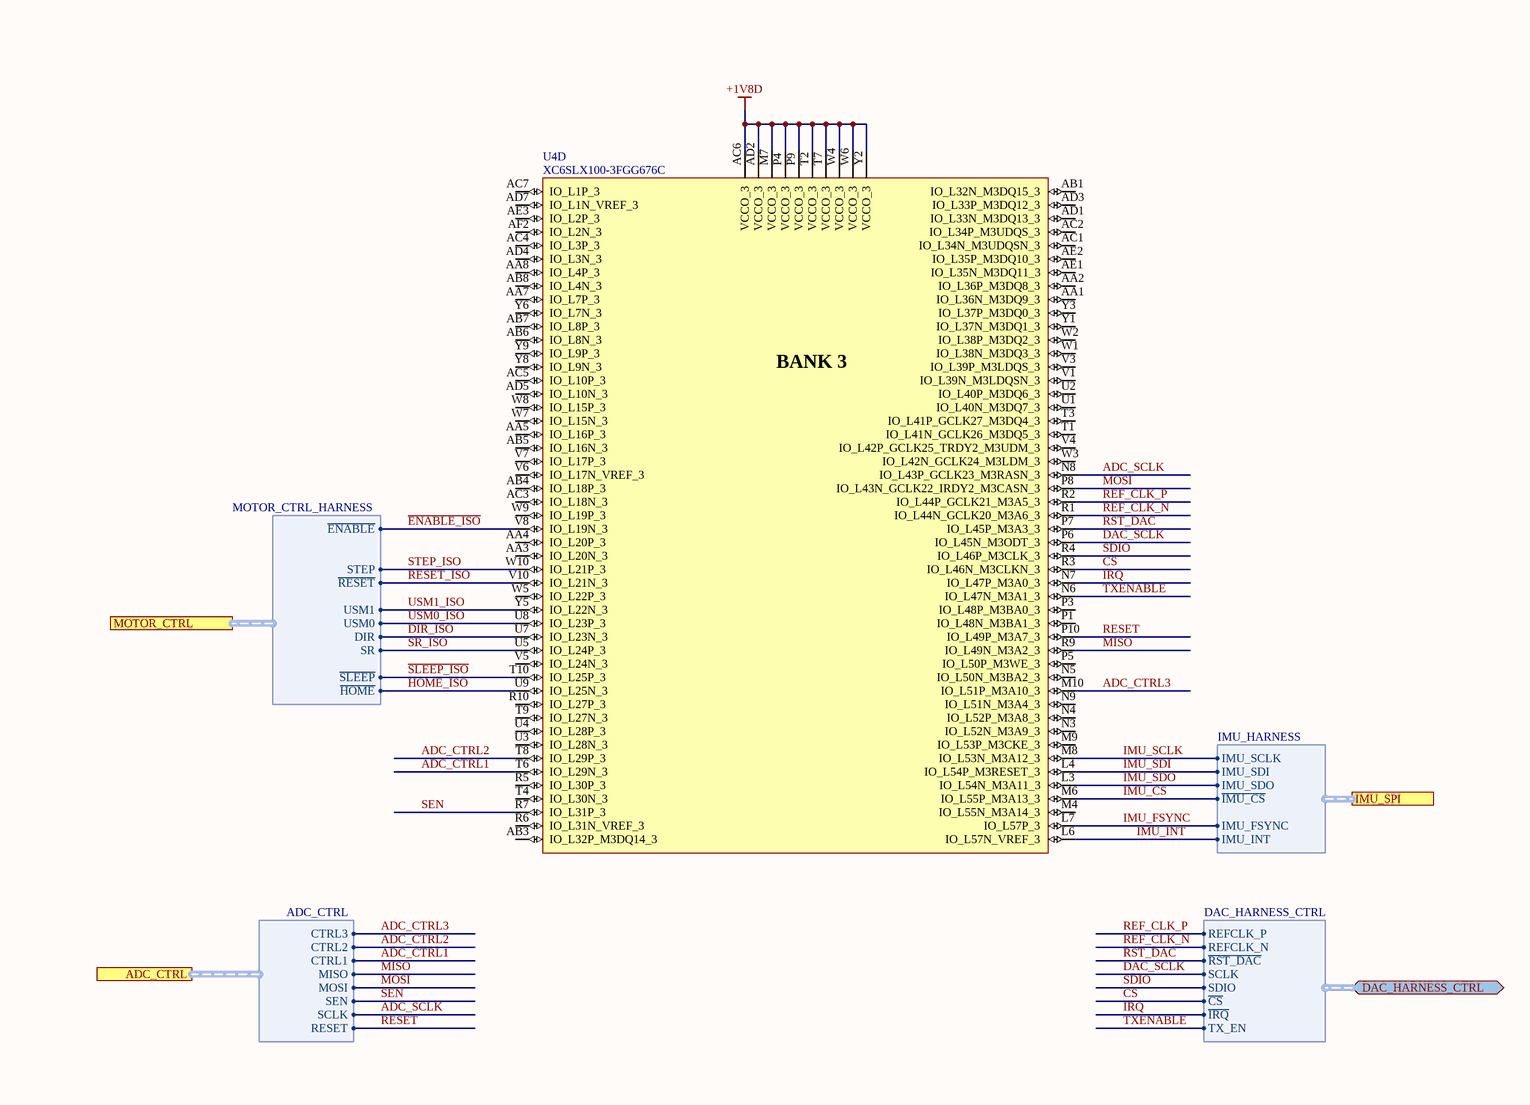
[diagram p39: FPGA_IO.SchDoc, bottom left]
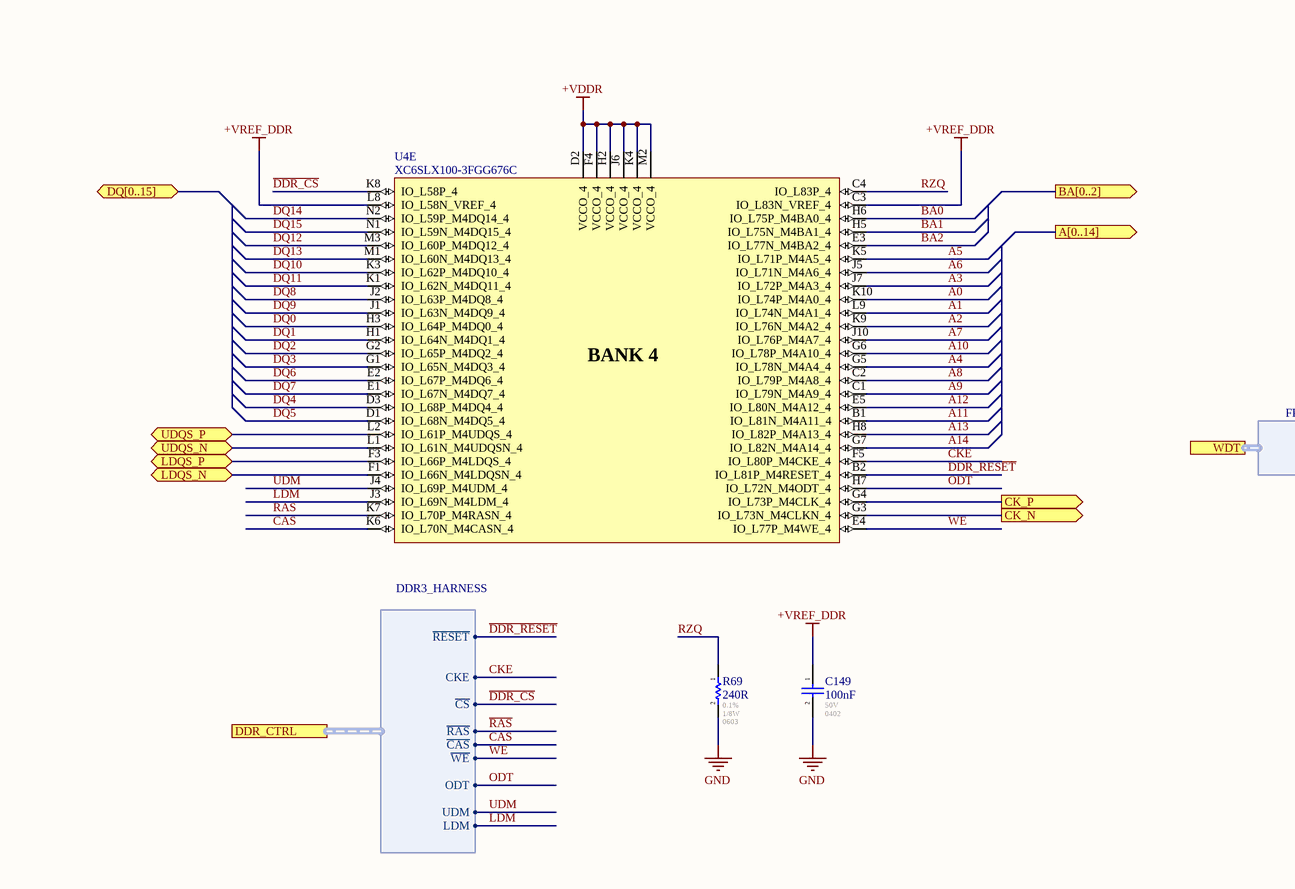
[diagram p40: FPGA_IO.SchDoc, bottom middle]
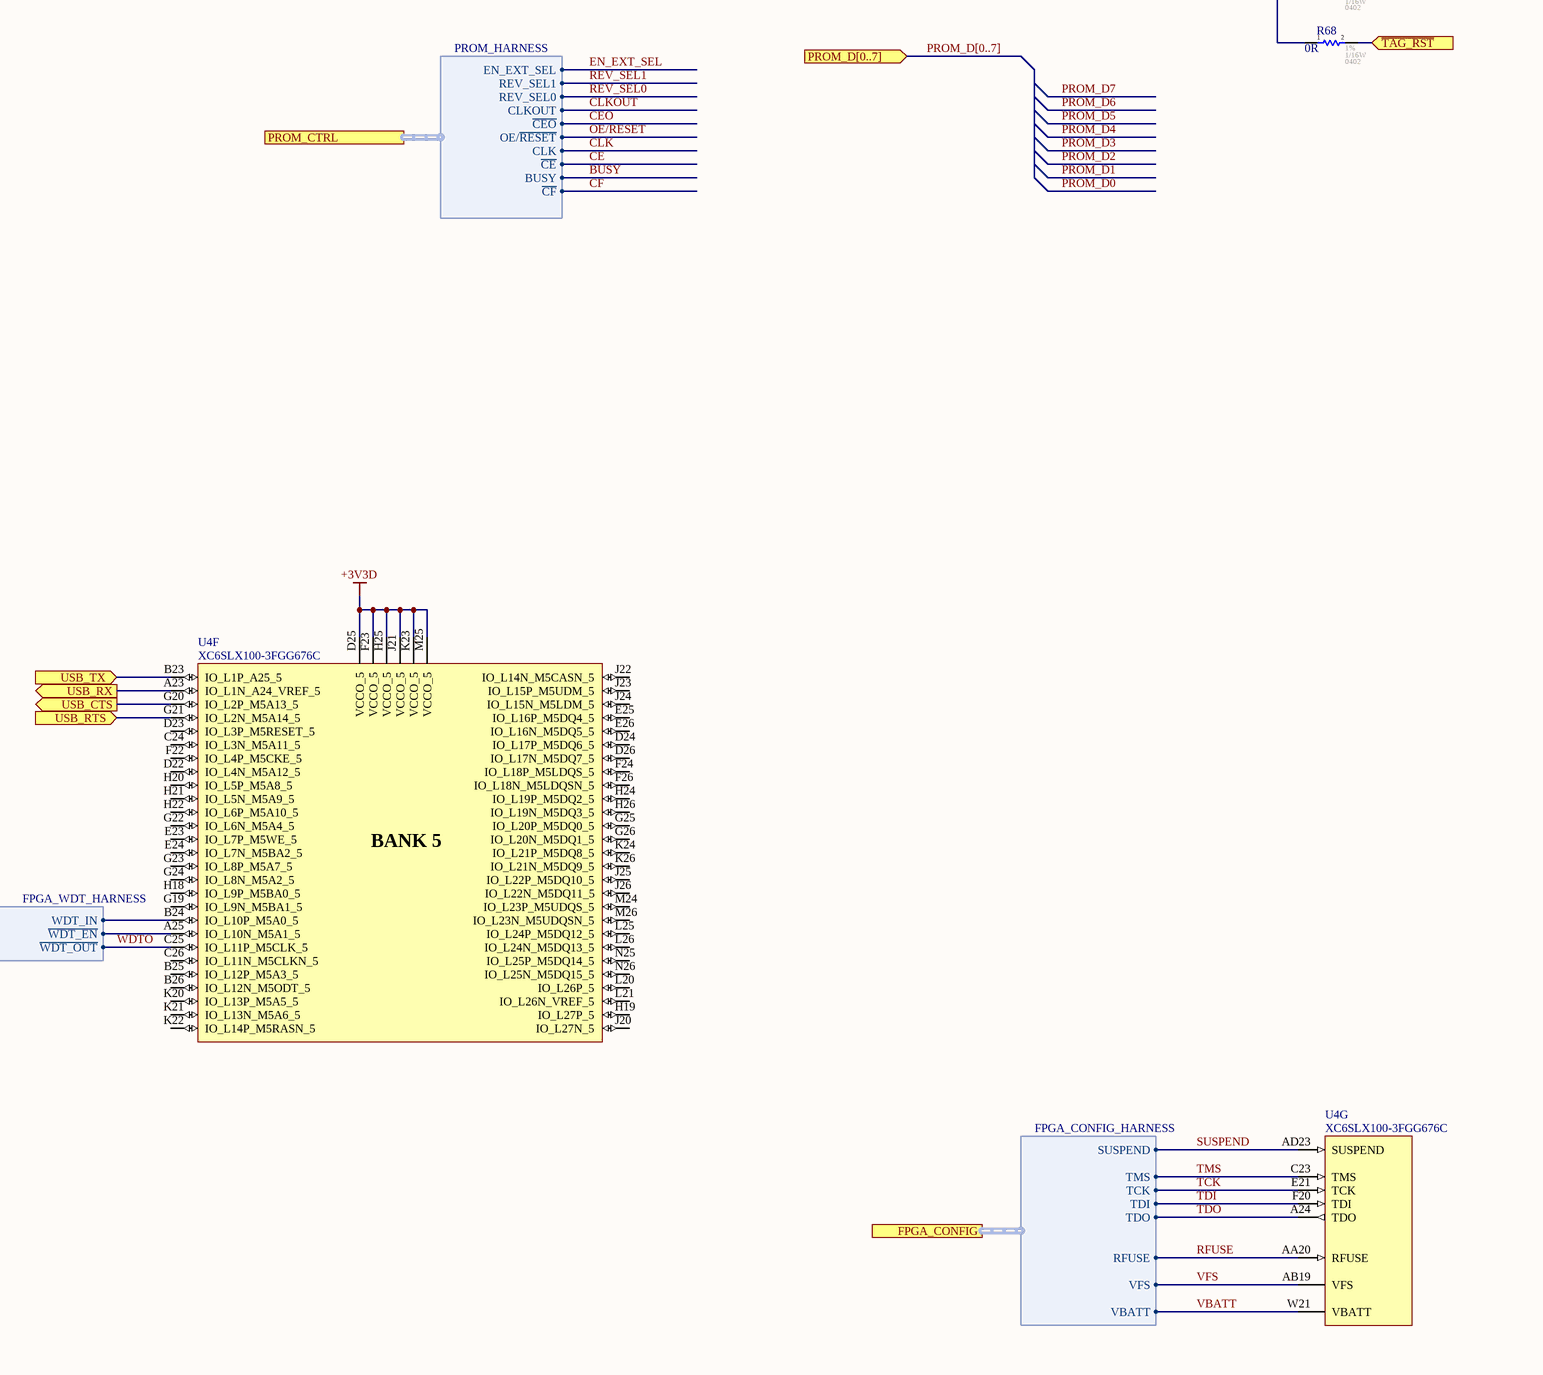
[diagram p41: FPGA_IO.SchDoc, bottom right]

### Parts
C149  100nF  Voltage - Rated: 50V  Footprint: 0402  [CAP_0402]
R58  DNF  Tolerance: 1%  Power: 1/16W  Package / Case: 0402  [RES_0402]
R59  DNF  Tolerance: 1%  Power: 1/16W  Package / Case: 0402  [RES_0402]
R60  0R  Tolerance: 1%  Power: 1/16W  Package / Case: 0402  [RES_0402]
R61  0R  Tolerance: 1%  Power: 1/16W  Package / Case: 0402  [RES_0402]
R62  100R  Tolerance: 1%  Power: 1/8W  Package / Case: 0402  [RES_0402]
R63  330R  Tolerance: 0.1%  Power: 1/8W  Package / Case: 0603  [RES_0603]
R64  100R  Tolerance: 1%  Power: 1/8W  Package / Case: 0402  [RES_0402]
R65  4K7  Tolerance: 1%  Power: 1/16W  Package / Case: 0402  [RES_0402]
R66  0R  Tolerance: 1%  Power: 1/16W  Package / Case: 0402  [RES_0402]
R67  0R  Tolerance: 1%  Power: 1/16W  Package / Case: 0402  [RES_0402]
R68  0R  Tolerance: 1%  Power: 1/16W  Package / Case: 0402  [RES_0402]
R69  240R  Tolerance: 0.1%  Power: 1/8W  Package / Case: 0603  [RES_0603]
U4  XC6SLX100-3FGG676C  [FPGA_XILINX_FGG676]  (parts A,B,C,D,E,F,G of 10)

### Ports
+3V3A_EN (out), +5V0A_EN (out), +6V_EN (out), -5V0A_EN (out), -6V_EN (out), A[0..14] (out), ADC_CTRL (harness ADC_CTRL), ADC_DATA_A (harness ADC_DATA_A), ADC_DATA_B (harness ADC_DATA_B), BA[0..2] (out), BTN_1 (in), BTN_2 (in), CAN (harness CAN_HARNESS), CK_N (out), CK_P (out), CLK_ADC_OUT_N (in), CLK_ADC_OUT_P (in), CLK_FPGA_100MHZ_N (in), CLK_FPGA_100MHZ_P (in), DAC_HARNESS_CTRL (bidir, harness DAC_HARNESS_CTRL), DAC_HARNESS_DATA (harness DAC_HARNESS_DATA), DDR_CTRL (harness DDR3_HARNESS), DDR_PWR_EN (out), DDR_SW_EN (out), DDR_VTT_EN (out), DEBUG_LED_[1..4] (out), DQ[0..15] (bidir), FAN_PWM (out), FAN_TACH (in), FPGA_CONFIG (harness FPGA_CONFIG_HARNESS), I2C_TEMP1 (harness I2C_HARNESS), I2C_TEMP2 (harness I2C_HARNESS), I2C_TEMP3 (harness I2C_HARNESS), IMU_SPI (harness IMU_HARNESS), IN[0..3] (in), IO_IN_EN (out), IO_OUT_EN (out), LDQS_N (bidir), LDQS_P (bidir), MII (harness ETHERNET_HARNESS), MOT_CURR_SPI (harness MOT_CURR_SPI), MOTOR_CTRL (harness MOTOR_CTRL_HARNESS), OUT[0..3] (out), PCIe (harness PCI_HARNESS), PLL_SPI (harness PLL_HARNESS), PROGRAM_B (in), PROM_CTRL (harness PROM_HARNESS), PROM_D[0..7] (in), RTC (harness RTC_HARNESS), SD (harness SD_CARD_HARNESS), SENSE_SPI (harness SENSE_SPI), SERIAL_NO (bidir), SMCLK_PCI (bidir), SMDAT_PCI (bidir), UDQS_N (bidir), UDQS_P (bidir), USB_CTS (out), USB_RTS (in), USB_RX (out), USB_TX (in), VTT_PG (out), WDT (harness FPGA_WDT_HARNESS), ~{PCI_RST} (in), ~{PERST_PCI} (in), ~{PRSNT_PCI} (in), ~{TAG_RST} (in), ~{WAKE_PCI} (in)

### Harnesses
DDR3_HARNESS: ~{RESET}, CKE, ~{CS}, ~{RAS}, ~{CAS}, ~{WE}, ODT, UDM, LDM
DAC_HARNESS_DATA: D0_N, D0_P, D1_P, D1_N, D2_P, D2_N, D3_P, D3_N, D4_P, D4_N, D5_P, D5_N, D6_P, D6_N, D7_P, D7_N, DCI_P, DCI_N, FRAME_P, FRAME_N
ADC_DATA_A: DA0_P, DA0_N, DA2_P, DA2_N, DA4_P, DA4_N, DA6_P, DA6_N, DA8_P, DA8_N, DA10_P, DA10_N, DA12_P, DA12_N
ADC_DATA_B: DB0_P, DB0_N, DB2_P, DB2_N, DB4_P, DB4_N, DB6_P, DB6_N, DB8_P, DB8_N, DB10_P, DB10_N, DB12_P, DB12_N
ADC_CTRL: RESET, SCLK, SEN, MOSI, MISO, CTRL1, CTRL2, CTRL3
PROM_HARNESS: EN_EXT_SEL, REV_SEL1, REV_SEL0, CLKOUT, ~{CEO}, OE/~{RESET}, CLK, ~{CE}, BUSY, ~{CF}
ETHERNET_HARNESS: MDIO, MDC, COL_CONFIG0, CRS_CONFIG1, INTRP, RXDV, RXER, RXD0, RXD1, RXD2, RXD3, RXC, TXEN, TXER, TXD0, TXD1, TXD2, TXD3, TXC, RST_ETH_PHY
MOTOR_CTRL_HARNESS: DIR, SR, STEP, ~{SLEEP}, ~{HOME}, USM1, USM0, ~{RESET}, ~{ENABLE}
PLL_HARNESS: ~{PLL_SYNC}, PLL_SPI_LE, PLL_SPI_CLK, PLL_SPI_MOSI, PLL_SPI_MISO, PLL_LOCK
FPGA_CONFIG_HARNESS: TCK, TDO, TDI, SUSPEND, TMS, RFUSE, VFS, VBATT
SENSE_SPI: ~{CS}, MISO, MOSI, SCLK
I2C_HARNESS: SDA, SCL
MOT_CURR_SPI: ~{CS}, FS, SCLK, DO
SD_CARD_HARNESS: CLK, CMD, D[0..3], DET
DAC_HARNESS_CTRL: ~{RST_DAC}, SCLK, SDIO, ~{CS}, ~{IRQ}, TX_EN, REFCLK_P, REFCLK_N
FPGA_WDT_HARNESS: WDT_IN, ~{WDT_EN}, ~{WDT_OUT}
PCI_HARNESS: HSI0+, HSI0-, HSO0+, HSO0-, REFCLK+, REFCLK-
CAN_HARNESS: TXD, RXD, AUXIN, SILENT, STBY
IMU_HARNESS: IMU_SCLK, IMU_SDI, IMU_SDO, ~{IMU_CS}, IMU_FSYNC, IMU_INT
RTC_HARNESS: SDA, SCL, MFP

### Nets
+1V8D: U4.AC6(VCCO_3) U4.AD2(VCCO_3) U4.M7(VCCO_3) U4.P4(VCCO_3) U4.P9(VCCO_3) U4.T2(VCCO_3) U4.T7(VCCO_3) U4.W4(VCCO_3) U4.W6(VCCO_3) U4.Y2(VCCO_3)
+3V3D: R58.1 R59.1 R62.1 R63.1 R65.1 U4.AB14(VCCO_2) U4.AB23(VCCO_1) U4.AC10(VCCO_2) U4.AC18(VCCO_2) U4.AC21(VCCO_2) U4.AD25(VCCO_1) U4.AE8(VCCO_2) U4.AE12(VCCO_2) U4.AE16(VCCO_2) U4.AE20(VCCO_2) U4.B3(VCCO_0) U4.B7(VCCO_0) U4.B11(VCCO_0) U4.B15(VCCO_0) U4.B19(VCCO_0) U4.C22(VCCO_0) U4.D9(VCCO_0) U4.D17(VCCO_0) U4.D25(VCCO_5) U4.E13(VCCO_0) U4.F23(VCCO_5) U4.G10(VCCO_0) U4.G18(VCCO_0) U4.H14(VCCO_0) U4.H25(VCCO_5) U4.J21(VCCO_5) U4.K23(VCCO_5) U4.M20(VCCO_1) U4.M25(VCCO_5) U4.P23(VCCO_1) U4.T25(VCCO_1) U4.U18(VCCO_1) U4.V21(VCCO_1) U4.W23(VCCO_1) U4.Y12(VCCO_2) U4.Y17(VCCO_2) U4.Y25(VCCO_1)
+VDDR: U4.D2(VCCO_4) U4.F4(VCCO_4) U4.H2(VCCO_4) U4.J6(VCCO_4) U4.K4(VCCO_4) U4.M2(VCCO_4)
+VREF_DDR: C149.1 U4.C3(IO_L83N_VREF_4) U4.L8(IO_L58N_VREF_4)
GND: C149.2 R60.2 R61.2 R64.2 R69.2
+3V3A_EN: U4.A20(IO_L64N_SCP4_0) ; port +3V3A_EN
+5V0A_EN: U4.A21(IO_L65N_SCP2_0) ; port +5V0A_EN
+6V_EN: U4.C21(IO_L65P_SCP3_0) ; port +6V_EN
-5V0A_EN: U4.B22(IO_L66P_SCP1_0) ; port -5V0A_EN
-6V_EN: U4.T20(IO_L64P_1) ; port -6V_EN
~{CAS}: U4.K6(IO_L70N_M4CASN_4) ; port DDR_CTRL.~{CAS}
~{CE}: R63.2 U4.AF23(DONE_2) ; port PROM_CTRL.~{CE}
~{CEO}: U4.AF18(IO_L9N_2) ; port PROM_CTRL.~{CEO}
~{CF}: U4.AA17(IO_L10N_2) ; port PROM_CTRL.~{CF}
~{CS}: U4.R3(IO_L46N_M3CLKN_3) ; port DAC_HARNESS_CTRL.~{CS}
~{DDR_CS}: U4.K8(IO_L58P_4) ; port DDR_CTRL.~{CS}
~{DDR_RESET}: U4.B2(IO_L81P_M4RESET_4) ; port DDR_CTRL.~{RESET}
~{ENABLE_ISO}: U4.V8(IO_L19N_3) ; port MOTOR_CTRL.~{ENABLE}
~{HOME_ISO}: U4.U9(IO_L25N_3) ; port MOTOR_CTRL.~{HOME}
~{IMU_CS}: U4.M6(IO_L55P_M3A13_3) ; port IMU_SPI.~{IMU_CS}
~{IRQ}: U4.N7(IO_L47P_M3A0_3) ; port DAC_HARNESS_CTRL.~{IRQ}
~{PCI_RST}: R67.2 ; port ~{PCI_RST}
~{PERST_PCI}: U4.G8(IO_L5P_0) ; port ~{PERST_PCI}
~{PLL_SYNC}: U4.H17(IO_L59N_0) ; port PLL_SPI.~{PLL_SYNC}
~{PRSNT_PCI}: U4.F7(IO_L5N_0) ; port ~{PRSNT_PCI}
~{RAS}: U4.K7(IO_L70P_M4RASN_4) ; port DDR_CTRL.~{RAS}
~{RESET_ISO}: U4.V10(IO_L21N_3) ; port MOTOR_CTRL.~{RESET}
~{RST_DAC}: U4.P7(IO_L45P_M3A3_3) ; port DAC_HARNESS_CTRL.~{RST_DAC}
~{SENSE_CS}: U4.B6(IO_L6P_0) ; port SENSE_SPI.~{CS}
~{SLEEP_ISO}: U4.T10(IO_L25P_3) ; port MOTOR_CTRL.~{SLEEP}
~{TAG_RST}: R68.2 ; port ~{TAG_RST}
~{WAKE_PCI}: U4.C7(IO_L12P_0) ; port ~{WAKE_PCI}
~{WDT_EN}: U4.A25(IO_L10N_M5A1_5) ; port WDT.~{WDT_EN}
~{WE}: U4.E4(IO_L77P_M4WE_4) ; port DDR_CTRL.~{WE}
A0: U4.K10(IO_L74P_M4A0_4)  [project net A0_9]
A1: U4.L9(IO_L74N_M4A1_4)  [project net A1_9]
A2: U4.K9(IO_L76N_M4A2_4)  [project net A2_9]
A3: U4.J7(IO_L72P_M4A3_4)  [project net A3_9]
A4: U4.G5(IO_L78N_M4A4_4)  [project net A4_9]
A5: U4.K5(IO_L71P_M4A5_4)  [project net A5_9]
A6: U4.J5(IO_L71N_M4A6_4)  [project net A6_9]
A7: U4.J10(IO_L76P_M4A7_4)  [project net A7_9]
A8: U4.C2(IO_L79P_M4A8_4)  [project net A8_9]
A9: U4.C1(IO_L79N_M4A9_4)  [project net A9_9]
A10: U4.G6(IO_L78P_M4A10_4)  [project net A10_9]
A11: U4.B1(IO_L81N_M4A11_4)  [project net A11_9]
A12: U4.E5(IO_L80N_M4A12_4)  [project net A12_9]
A13: U4.H8(IO_L82P_M4A13_4)  [project net A13_9]
A14: U4.G7(IO_L82N_M4A14_4)  [project net A14_9]
ADC_CTRL1: U4.T6(IO_L29N_3) ; port ADC_CTRL.CTRL1
ADC_CTRL2: U4.T8(IO_L29P_3) ; port ADC_CTRL.CTRL2
ADC_CTRL3: U4.M10(IO_L51P_M3A10_3) ; port ADC_CTRL.CTRL3
ADC_SCLK: U4.N8(IO_L43P_GCLK23_M3RASN_3) ; port ADC_CTRL.SCLK
AUXIN: U4.W19(IO_L68N_1) ; port CAN.AUXIN
BA0: U4.H6(IO_L75P_M4BA0_4)  [project net BA0_9]
BA1: U4.H5(IO_L75N_M4BA1_4)  [project net BA1_9]
BA2: U4.E3(IO_L77N_M4BA2_4)  [project net BA2_9]
BTN_1: U4.Y15(IO_L20P_2) ; port BTN_1
BTN_2: U4.Y14(IO_L28P_2) ; port BTN_2
BUSY: U4.Y16(IO_L10P_2) ; port PROM_CTRL.BUSY
CK_N: U4.G3(IO_L73N_M4CLKN_4) ; port CK_N
CK_P: U4.G4(IO_L73P_M4CLK_4) ; port CK_P
CKE: U4.F5(IO_L80P_M4CKE_4) ; port DDR_CTRL.CKE
CLK: R62.2 R64.1 U4.AD22(IO_L1P_CCLK_2) ; port PROM_CTRL.CLK
CLK_ADC_OUT_N: U4.A13(IO_L34N_GCLK18_0) ; port CLK_ADC_OUT_N
CLK_ADC_OUT_P: U4.C13(IO_L34P_GCLK19_0) ; port CLK_ADC_OUT_P
CLK_FPGA_100MHZ_N: U4.B14(IO_L35P_GCLK17_0) ; port CLK_FPGA_100MHZ_N
CLK_FPGA_100MHZ_P: U4.A14(IO_L35N_GCLK16_0) ; port CLK_FPGA_100MHZ_P
CLKOUT: U4.AD18(IO_L9P_2) ; port PROM_CTRL.CLKOUT
COL_CONFIG0: U4.R24(IO_L39N_M1ODT_1) ; port MII.COL_CONFIG0
CRS_CONFIG1: U4.N20(IO_L40P_GCLK11_M1A5_1) ; port MII.CRS_CONFIG1
D0_N: U4.F11(IO_L23N_0) ; port DAC_HARNESS_DATA.D0_N
D0_P: U4.D11(IO_L23P_0) ; port DAC_HARNESS_DATA.D0_P
D1_N: U4.E9(IO_L15N_0) ; port DAC_HARNESS_DATA.D1_N
D1_P: U4.F9(IO_L15P_0) ; port DAC_HARNESS_DATA.D1_P
D2_N: U4.A11(IO_L24N_0) ; port DAC_HARNESS_DATA.D2_N
D2_P: U4.C11(IO_L24P_0) ; port DAC_HARNESS_DATA.D2_P
D3_N: U4.C10(IO_L19N_0) ; port DAC_HARNESS_DATA.D3_N
D3_P: U4.D10(IO_L19P_0) ; port DAC_HARNESS_DATA.D3_P
D4_N: U4.C8(IO_L14N_0) ; port DAC_HARNESS_DATA.D4_N
D4_P: U4.D8(IO_L14P_0) ; port DAC_HARNESS_DATA.D4_P
D5_N: U4.A8(IO_L16N_0) ; port DAC_HARNESS_DATA.D5_N
D5_P: U4.B8(IO_L16P_0) ; port DAC_HARNESS_DATA.D5_P
D6_N: U4.A9(IO_L17N_0) ; port DAC_HARNESS_DATA.D6_N
D6_P: U4.C9(IO_L17P_0) ; port DAC_HARNESS_DATA.D6_P
D7_N: U4.A10(IO_L22N_0) ; port DAC_HARNESS_DATA.D7_N
D7_P: U4.B10(IO_L22P_0) ; port DAC_HARNESS_DATA.D7_P
DA0_N: U4.C14(IO_L36N_GCLK14_0) ; port ADC_DATA_A.DA0_N
DA0_P: U4.D14(IO_L36P_GCLK15_0) ; port ADC_DATA_A.DA0_P
DA2_N: U4.A15(IO_L37N_GCLK12_0) ; port ADC_DATA_A.DA2_N
DA2_P: U4.C15(IO_L37P_GCLK13_0) ; port ADC_DATA_A.DA2_P
DA4_N: U4.A16(IO_L38N_VREF_0) ; port ADC_DATA_A.DA4_N
DA4_P: U4.B16(IO_L38P_0) ; port ADC_DATA_A.DA4_P
DA6_N: U4.G14(IO_L43N_0) ; port ADC_DATA_A.DA6_N
DA6_P: U4.J14(IO_L43P_0) ; port ADC_DATA_A.DA6_P
DA8_N: U4.H15(IO_L51N_0) ; port ADC_DATA_A.DA8_N
DA8_P: U4.J15(IO_L51P_0) ; port ADC_DATA_A.DA8_P
DA10_N: U4.C16(IO_L46N_0) ; port ADC_DATA_A.DA10_N
DA10_P: U4.D16(IO_L46P_0) ; port ADC_DATA_A.DA10_P
DA12_N: U4.F15(IO_L47N_0) ; port ADC_DATA_A.DA12_N
DA12_P: U4.G16(IO_L47P_0) ; port ADC_DATA_A.DA12_P
DAC_SCLK: U4.P6(IO_L45N_M3ODT_3) ; port DAC_HARNESS_CTRL.SCLK
DB0_N: U4.E16(IO_L49N_0) ; port ADC_DATA_B.DB0_N
DB0_P: U4.F16(IO_L49P_0) ; port ADC_DATA_B.DB0_P
DB2_N: U4.A17(IO_L50N_0) ; port ADC_DATA_B.DB2_N
DB2_P: U4.C17(IO_L50P_0) ; port ADC_DATA_B.DB2_P
DB4_N: U4.D19(IO_L54N_0) ; port ADC_DATA_B.DB4_N
DB4_P: U4.E19(IO_L54P_0) ; port ADC_DATA_B.DB4_P
DB6_N: U4.D20(IO_L58N_0) ; port ADC_DATA_B.DB6_N
DB6_P: U4.E20(IO_L58P_0) ; port ADC_DATA_B.DB6_P
DB8_N: U4.C20(IO_L56N_0) ; port ADC_DATA_B.DB8_N
DB8_P: U4.D21(IO_L56P_0) ; port ADC_DATA_B.DB8_P
DB10_N: U4.C18(IO_L52N_0) ; port ADC_DATA_B.DB10_N
DB10_P: U4.D18(IO_L52P_0) ; port ADC_DATA_B.DB10_P
DB12_N: U4.E17(IO_L48N_0) ; port ADC_DATA_B.DB12_N
DB12_P: U4.F17(IO_L48P_0) ; port ADC_DATA_B.DB12_P
DCI_N: U4.D7(IO_L13N_0) ; port DAC_HARNESS_DATA.DCI_N
DCI_P: U4.E8(IO_L13P_0) ; port DAC_HARNESS_DATA.DCI_P
DDR_PWR_EN: U4.AE26(IO_L52N_M1DQ15_1) ; port DDR_PWR_EN
DDR_SW_EN: U4.AA25(IO_L51P_M1DQ12_1) ; port DDR_SW_EN
DDR_VTT_EN: U4.AE25(IO_L52P_M1DQ14_1) ; port DDR_VTT_EN
DEBUG_LED_1: U4.AF9(IO_L48N_RDWR_B_VREF_2)
DEBUG_LED_2: U4.AD11(IO_L45N_2)
DEBUG_LED_3: U4.AE11(IO_L47P_2)
DEBUG_LED_4: U4.AF11(IO_L47N_2)
DIR_ISO: U4.U7(IO_L23N_3) ; port MOTOR_CTRL.DIR
DQ0: U4.H3(IO_L64P_M4DQ0_4)  [project net DQ0_9]
DQ1: U4.H1(IO_L64N_M4DQ1_4)  [project net DQ1_9]
DQ2: U4.G2(IO_L65P_M4DQ2_4)  [project net DQ2_9]
DQ3: U4.G1(IO_L65N_M4DQ3_4)  [project net DQ3_9]
DQ4: U4.D3(IO_L68P_M4DQ4_4)  [project net DQ4_9]
DQ5: U4.D1(IO_L68N_M4DQ5_4)  [project net DQ5_9]
DQ6: U4.E2(IO_L67P_M4DQ6_4)  [project net DQ6_9]
DQ7: U4.E1(IO_L67N_M4DQ7_4)  [project net DQ7_9]
DQ8: U4.J2(IO_L63P_M4DQ8_4)  [project net DQ8_9]
DQ9: U4.J1(IO_L63N_M4DQ9_4)  [project net DQ9_9]
DQ10: U4.K3(IO_L62P_M4DQ10_4)  [project net DQ10_9]
DQ11: U4.K1(IO_L62N_M4DQ11_4)  [project net DQ11_9]
DQ12: U4.M3(IO_L60P_M4DQ12_4)  [project net DQ12_9]
DQ13: U4.M1(IO_L60N_M4DQ13_4)  [project net DQ13_9]
DQ14: U4.N2(IO_L59P_M4DQ14_4)  [project net DQ14_9]
DQ15: U4.N1(IO_L59N_M4DQ15_4)  [project net DQ15_9]
EN_EXT_SEL: U4.AD19(IO_L7N_2) ; port PROM_CTRL.EN_EXT_SEL
FAN_PWM: U4.P18(IO_L56N_1) ; port FAN_PWM
FAN_TACH: U4.R20(IO_L57P_1) ; port FAN_TACH
FRAME_N: U4.C6(IO_L8N_VREF_0) ; port DAC_HARNESS_DATA.FRAME_N
FRAME_P: U4.D6(IO_L8P_0) ; port DAC_HARNESS_DATA.FRAME_P
IMU_FSYNC: U4.L7(IO_L57P_3) ; port IMU_SPI.IMU_FSYNC
IMU_INT: U4.L6(IO_L57N_VREF_3) ; port IMU_SPI.IMU_INT
IMU_SCLK: U4.M8(IO_L53N_M3A12_3) ; port IMU_SPI.IMU_SCLK
IMU_SDI: U4.L4(IO_L54P_M3RESET_3) ; port IMU_SPI.IMU_SDI
IMU_SDO: U4.L3(IO_L54N_M3A11_3) ; port IMU_SPI.IMU_SDO
IN0: U4.AF12(IO_L32N_GCLK28_2)
IN1: U4.AD12(IO_L32P_GCLK29_2)
IN2: U4.AD13(IO_L31N_GCLK30_D15_2)
IN3: U4.AC13(IO_L31P_GCLK31_D14_2)
INTRP: U4.M21(IO_L40N_GCLK10_M1A6_1) ; port MII.INTRP
IO_IN_EN: U4.AA12(IO_L41P_2) ; port IO_IN_EN
IO_OUT_EN: U4.AC12(IO_L41N_VREF_2) ; port IO_OUT_EN
LDM: U4.J3(IO_L69N_M4LDM_4) ; port DDR_CTRL.LDM
LDQS_N: U4.F1(IO_L66N_M4LDQSN_4) ; port LDQS_N
LDQS_P: U4.F3(IO_L66P_M4LDQS_4) ; port LDQS_P
M0: R58.2 R60.1 U4.AF22(IO_L1N_M0_CMPMISO_2)  [project net M0_9]
M1: R59.2 R61.1 U4.AD16(IO_L13P_M1_2)  [project net M1_9]
MDC: U4.R23(IO_L39P_M1A3_1) ; port MII.MDC
MDIO: U4.AB24(IO_L49P_M1DQ10_1) ; port MII.MDIO
MISO: U4.R9(IO_L49N_M3A2_3) ; port ADC_CTRL.MISO
MOSI: U4.P8(IO_L43N_GCLK22_IRDY2_M3CASN_3) ; port ADC_CTRL.MOSI
ODT: U4.H7(IO_L72N_M4ODT_4) ; port DDR_CTRL.ODT
OE/RESET: R65.2 U4.AE4(IO_L65P_INIT_B_2) ; port PROM_CTRL.OE/~{RESET}
OUT0: U4.AB13(IO_L34N_2)
OUT1: U4.AA13(IO_L34P_2)
OUT2: U4.Y13(IO_L33N_2)
OUT3: U4.W13(IO_L33P_2)
PLL_LOCK: U4.B20(IO_L64P_SCP5_0) ; port PLL_SPI.PLL_LOCK
PLL_SPI_CLK: U4.A18(IO_L62N_VREF_0) ; port PLL_SPI.PLL_SPI_CLK
PLL_SPI_LE: U4.B18(IO_L62P_0) ; port PLL_SPI.PLL_SPI_LE
PLL_SPI_MISO: U4.A19(IO_L63N_SCP6_0) ; port PLL_SPI.PLL_SPI_MISO
PLL_SPI_MOSI: U4.C19(IO_L63P_SCP7_0) ; port PLL_SPI.PLL_SPI_MOSI
PROGRAM_B: R66.2 R67.1 R68.1 U4.AF3(PROGRAM_B_2) ; port PROGRAM_B
PROM_D0: U4.AD20(IO_L3P_D0_DIN_MISO_MISO1_2)
PROM_D1: U4.AE17(IO_L12P_D1_MISO2_2)
PROM_D2: U4.AF17(IO_L12N_D2_MISO3_2)
PROM_D3: U4.AD10(IO_L49P_D3_2)
PROM_D4: U4.AF10(IO_L49N_D4_2)
PROM_D5: U4.AE7(IO_L62P_D5_2)
PROM_D6: U4.AF7(IO_L62N_D6_2)
PROM_D7: U4.AE9(IO_L48P_D7_2)
REF_CLK_N: U4.R1(IO_L44N_GCLK20_M3A6_3) ; port DAC_HARNESS_CTRL.REFCLK_N
REF_CLK_P: U4.R2(IO_L44P_GCLK21_M3A5_3) ; port DAC_HARNESS_CTRL.REFCLK_P
RESET: U4.P10(IO_L49P_M3A7_3) ; port ADC_CTRL.RESET
REV_SEL0: U4.W17(IO_L8N_2) ; port PROM_CTRL.REV_SEL0
REV_SEL1: U4.V16(IO_L8P_2) ; port PROM_CTRL.REV_SEL1
RFUSE: U4.AA20(RFUSE) ; port FPGA_CONFIG.RFUSE
RST_ETH_PHY: U4.N19(IO_L36N_A8_M1BA1_1) ; port MII.RST_ETH_PHY
RTC_MFP: U4.L24(IO_L29N_A22_M1A14_1) ; port RTC.MFP
RTC_SCL: U4.K19(IO_L28N_VREF_1) ; port RTC.SCL
RTC_SDA: U4.L19(IO_L28P_1) ; port RTC.SDA
RXC: U4.W25(IO_L44P_A3_M1DQ6_1) ; port MII.RXC
RXD: U4.W18(IO_L68P_1) ; port CAN.RXD
RXD0: U4.V23(IO_L42P_GCLK7_M1UDM_1) ; port MII.RXD0
RXD1: U4.W24(IO_L42N_GCLK6_TRDY1_M1LDM_1) ; port MII.RXD1
RXD2: U4.U25(IO_L43P_GCLK5_M1DQ4_1) ; port MII.RXD2
RXD3: U4.U26(IO_L43N_GCLK4_M1DQ5_1) ; port MII.RXD3
RXDV: U4.P21(IO_L41P_GCLK9_IRDY1_M1RASN_1) ; port MII.RXDV
RXER: U4.P22(IO_L41N_GCLK8_M1CASN_1) ; port MII.RXER
RZQ: R69.1 U4.C4(IO_L83P_4)  [project net RZQ_9]
SCL1: U4.AA11(IO_L43P_2) ; port I2C_TEMP1.SCL
SCL2: U4.R25(IO_L35P_A11_M1A7_1) ; port I2C_TEMP2.SCL
SCL3: U4.AC16(IO_L17P_2) ; port I2C_TEMP3.SCL
SD_CLK: U4.R19(IO_L57N_1) ; port SD.CLK
SD_CMD: U4.R17(IO_L58P_1) ; port SD.CMD
SD_D0: U4.U24(IO_L53N_VREF_1)
SD_D1: U4.R22(IO_L55P_1)
SD_D2: U4.R21(IO_L55N_1)
SD_D3: U4.P17(IO_L56P_1)
SD_DET: U4.R18(IO_L58N_1) ; port SD.DET
SDA1: U4.AB11(IO_L43N_2) ; port I2C_TEMP1.SDA
SDA2: U4.R26(IO_L35N_A10_M1A2_1) ; port I2C_TEMP2.SDA
SDA3: U4.AD17(IO_L17N_2) ; port I2C_TEMP3.SDA
SDIO: U4.R4(IO_L46P_M3CLK_3) ; port DAC_HARNESS_CTRL.SDIO
SEN: U4.R7(IO_L31P_3) ; port ADC_CTRL.SEN
SENSE_MISO: U4.A7(IO_L12N_0) ; port SENSE_SPI.MISO
SENSE_MOSI: U4.A6(IO_L6N_0) ; port SENSE_SPI.MOSI
SENSE_SCLK: U4.A5(IO_L4N_0) ; port SENSE_SPI.SCLK
SERIAL_NO: U4.P26(IO_L33N_A14_M1A4_1) ; port SERIAL_NO
SILENT: U4.AB21(IO_L69P_1) ; port CAN.SILENT
SMCLK_PCI: U4.E10(IO_L18P_0) ; port SMCLK_PCI
SMDAT_PCI: U4.F10(IO_L18N_0) ; port SMDAT_PCI
SR_ISO: U4.U5(IO_L24P_3) ; port MOTOR_CTRL.SR
STBY: U4.AB22(IO_L69N_VREF_1) ; port CAN.STBY
STEP_ISO: U4.W10(IO_L21P_3) ; port MOTOR_CTRL.STEP
SUSPEND: U4.AD23(SUSPEND) ; port FPGA_CONFIG.SUSPEND
TCK: U4.E21(TCK) ; port FPGA_CONFIG.TCK
TDI: U4.F20(TDI) ; port FPGA_CONFIG.TDI
TDO: U4.A24(TDO) ; port FPGA_CONFIG.TDO  [project net FGPA_TDO]
TMS: U4.C23(TMS) ; port FPGA_CONFIG.TMS
TXC: U4.W26(IO_L44N_A2_M1DQ7_1) ; port MII.TXC
TXD: U4.AF25(IO_L67N_1) ; port CAN.TXD
TXD0: U4.T24(IO_L46P_FCS_B_M1DQ2_1) ; port MII.TXD0
TXD1: U4.T26(IO_L46N_FOE_B_M1DQ3_1) ; port MII.TXD1
TXD2: U4.Y24(IO_L47P_FWE_B_M1DQ0_1) ; port MII.TXD2
TXD3: U4.Y26(IO_L47N_LDC_M1DQ1_1) ; port MII.TXD3
TXEN: U4.V24(IO_L45P_A1_M1LDQS_1) ; port MII.TXEN
TXENABLE: U4.N6(IO_L47N_M3A1_3) ; port DAC_HARNESS_CTRL.TX_EN
TXER: U4.V26(IO_L45N_A0_M1LDQSN_1) ; port MII.TXER
UDM: U4.J4(IO_L69P_M4UDM_4) ; port DDR_CTRL.UDM
UDQS_N: U4.L1(IO_L61N_M4UDQSN_4) ; port UDQS_N
UDQS_P: U4.L2(IO_L61P_M4UDQS_4) ; port UDQS_P
USB_CTS: U4.G20(IO_L2P_M5A13_5) ; port USB_CTS
USB_RTS: U4.G21(IO_L2N_M5A14_5) ; port USB_RTS
USB_RX: U4.A23(IO_L1N_A24_VREF_5) ; port USB_RX
USB_TX: U4.B23(IO_L1P_A25_5) ; port USB_TX
USM0_ISO: U4.U8(IO_L23P_3) ; port MOTOR_CTRL.USM0
USM1_ISO: U4.Y5(IO_L22N_3) ; port MOTOR_CTRL.USM1
VBATT: U4.W21(VBATT) ; port FPGA_CONFIG.VBATT
VFS: U4.AB19(VFS) ; port FPGA_CONFIG.VFS
VTT_PG: U4.AA26(IO_L51N_M1DQ13_1) ; port VTT_PG
WDT_IN: U4.B24(IO_L10P_M5A0_5) ; port WDT.WDT_IN
WDTO: R66.1 U4.C25(IO_L11P_M5CLK_5) ; port WDT.~{WDT_OUT}
NetU4_A2: U4.A2(IO_L1N_VREF_0) ; port PCIe.HSO0-
NetU4_A3: U4.A3(IO_L1P_HSWAPEN_0) ; port PCIe.HSO0+
NetU4_A4: U4.A4(IO_L2N_0) ; port PCIe.REFCLK-
NetU4_B4: U4.B4(IO_L2P_0) ; port PCIe.REFCLK+
NetU4_D5: U4.D5(IO_L3N_0) ; port PCIe.HSI0-
NetU4_E6: U4.E6(IO_L3P_0) ; port PCIe.HSI0+
NetU4_T18: U4.T18(IO_L60P_1) ; port MOT_CURR_SPI.FS
NetU4_T19: U4.T19(IO_L60N_1) ; port MOT_CURR_SPI.SCLK
NetU4_U21: U4.U21(IO_L61P_1) ; port MOT_CURR_SPI.DO
NetU4_U23: U4.U23(IO_L59N_1) ; port MOT_CURR_SPI.~{CS}

Not connected (* = marked no-connect by the designer): U4 A12(IO_L26N_0) A22(IO_L66N_SCP0_0) AA1(IO_L36N_M3DQ9_3) AA2(IO_L36P_M3DQ8_3) AA3(IO_L20N_3) AA4(IO_L20P_3) AA5(IO_L16P_3) AA7(IO_L7P_3) AA8(IO_L4P_3) AA9(IO_L61P_2) AA14(IO_L28N_2) AA15(IO_L20N_2) AA18(IO_L11P_2) AA19(IO_L6N_2) AA22(IO_L73N_1) AA23(IO_L63P_1) AA24(IO_L63N_1) AB1(IO_L32N_M3DQ15_3) AB3(IO_L32P_M3DQ14_3) AB4(IO_L18P_3) AB5(IO_L16N_3) AB6(IO_L8N_3) AB7(IO_L8P_3) AB8(IO_L4N_3) AB9(IO_L61N_VREF_2) AB10(IO_L51N_2) AB15(IO_L19P_2) AB17(IO_L15P_2) AB18(IO_L11N_2) AB26(IO_L49N_M1DQ11_1) AC1(IO_L34N_M3UDQSN_3) AC2(IO_L34P_M3UDQS_3) AC3(IO_L18N_3) AC4(IO_L3P_3) AC5(IO_L10P_3) AC7(IO_L1P_3) AC9(IO_L58P_2) AC11(IO_L45P_2) AC14(IO_L19N_2) AC15(IO_L16P_2) AC17(IO_L15N_2) AC19(IO_L7P_2) AC20(IO_L5P_2) AC22(CMPCS_B_2) AC23(IO_L65P_1) AC24(IO_L65N_1) AC25(IO_L50P_M1UDQS_1) AC26(IO_L50N_M1UDQSN_1) AD1(IO_L33N_M3DQ13_3) AD3(IO_L33P_M3DQ12_3) AD4(IO_L3N_3) AD5(IO_L10N_3) AD6(IO_L63P_2) AD7(IO_L1N_VREF_3) AD8(IO_L53P_2) AD9(IO_L58N_2) AD14(IO_L29P_GCLK3_2) AD15(IO_L16N_VREF_2) AD21(IO_L5N_2) AD24(IO_L48P_HDC_M1DQ8_1) AD26(IO_L48N_M1DQ9_1) AE1(IO_L35N_M3DQ11_3) AE2(IO_L35P_M3DQ10_3) AE3(IO_L2P_3) AE5(IO_L64P_D8_2) AE13(IO_L30P_GCLK1_D13_2) AE15(IO_L14P_D11_2) AE19(IO_L4P_2) AE21(IO_L2P_CMPCLK_2) AE23(IO_L74P_AWAKE_1) AE24(IO_L67P_1) AF2(IO_L2N_3) AF4(IO_L65N_CSO_B_2) AF5(IO_L64N_D9_2) AF6(IO_L63N_2) AF8(IO_L53N_2) AF13(IO_L30N_GCLK0_USERCCLK_2) AF14(IO_L29N_GCLK2_2) AF15(IO_L14N_D12_2) AF16(IO_L13N_D10_2) AF19(IO_L4N_VREF_2) AF20(IO_L3N_MOSI_CSI_B_MISO0_2) AF21(IO_L2N_CMPMOSI_2) AF24(IO_L74N_DOUT_BUSY_1) B12(IO_L26P_0) B25(IO_L12P_M5A3_5) B26(IO_L12N_M5ODT_5) C5(IO_L4P_0) C12(IO_L31N_0) C24(IO_L3N_M5A11_5) C26(IO_L11N_M5CLKN_5) D12(IO_L31P_0) D13(IO_L33N_0) D15(IO_L44N_0) D22(IO_L4N_M5A12_5) D23(IO_L3P_M5RESET_5) D24(IO_L17P_M5DQ6_5) D26(IO_L17N_M5DQ7_5) E14(IO_L44P_0) E18(IO_L57N_0) E23(IO_L7P_M5WE_5) E24(IO_L7N_M5BA2_5) E25(IO_L16P_M5DQ4_5) E26(IO_L16N_M5DQ5_5) F13(IO_L33P_0) F18(IO_L57P_0) F22(IO_L4P_M5CKE_5) F24(IO_L18P_M5LDQS_5) F26(IO_L18N_M5LDQSN_5) G17(IO_L55N_0) G19(IO_L9N_M5BA1_5) G22(IO_L6N_M5A4_5) G23(IO_L8P_M5A7_5) G24(IO_L8N_M5A2_5) G25(IO_L20P_M5DQ0_5) G26(IO_L20N_M5DQ1_5) H16(IO_L55P_0) H18(IO_L9P_M5BA0_5) H19(IO_L27P_5) H20(IO_L5P_M5A8_5) H21(IO_L5N_M5A9_5) H22(IO_L6P_M5A10_5) H24(IO_L19P_M5DQ2_5) H26(IO_L19N_M5DQ3_5) J17(IO_L59P_0) J20(IO_L27N_5) J22(IO_L14N_M5CASN_5) J23(IO_L15P_M5UDM_5) J24(IO_L15N_M5LDM_5) J25(IO_L22P_M5DQ10_5) J26(IO_L22N_M5DQ11_5) K18(IO_L32N_A16_M1A9_1) K20(IO_L13P_M5A5_5) K21(IO_L13N_M5A6_5) K22(IO_L14P_M5RASN_5) K24(IO_L21P_M5DQ8_5) K26(IO_L21N_M5DQ9_5) L17(IO_L32P_A17_M1A8_1) L18(IO_L34N_A12_M1BA2_1) L20(IO_L26P_5) L21(IO_L26N_VREF_5) L23(IO_L29P_A23_M1A13_1) L25(IO_L24P_M5DQ12_5) L26(IO_L24N_M5DQ13_5) M4(IO_L55N_M3A14_3) M9(IO_L53P_M3CKE_3) M18(IO_L36P_A9_M1BA0_1) M19(IO_L34P_A13_M1WE_1) M23(IO_L31P_A19_M1CKE_1) M24(IO_L23P_M5UDQS_5) M26(IO_L23N_M5UDQSN_5) N3(IO_L52N_M3A9_3) N4(IO_L52P_M3A8_3) N5(IO_L50N_M3BA2_3) N9(IO_L51N_M3A4_3) N17(IO_L38P_A5_M1CLK_1) N18(IO_L38N_A4_M1CLKN_1) N21(IO_L30N_A20_M1A11_1) N22(IO_L37P_A7_M1A0_1) N23(IO_L37N_A6_M1A1_1) N24(IO_L31N_A18_M1A12_1) N25(IO_L25P_M5DQ14_5) N26(IO_L25N_M5DQ15_5) P1(IO_L48N_M3BA1_3) P3(IO_L48P_M3BA0_3) P5(IO_L50P_M3WE_3) P20(IO_L30P_A21_M1RESET_1) P24(IO_L33P_A15_M1A10_1) R5(IO_L30P_3) R6(IO_L31N_VREF_3) R10(IO_L27P_3) T1(IO_L41N_GCLK26_M3DQ5_3) T3(IO_L41P_GCLK27_M3DQ4_3) T4(IO_L30N_3) T9(IO_L27N_3) T22(IO_L59P_1) T23(IO_L53P_1) U1(IO_L40N_M3DQ7_3) U2(IO_L40P_M3DQ6_3) U3(IO_L28N_3) U4(IO_L28P_3) U12(IO_L50N_2) U13(IO_L50P_2) U15(IO_L42P_2) U17(IO_L62P_1) U19(IO_L70P_1) U20(IO_L64N_1) U22(IO_L61N_1) V1(IO_L39N_M3LDQSN_3) V3(IO_L39P_M3LDQS_3) V4(IO_L42P_GCLK25_TRDY2_M3UDM_3) V5(IO_L24N_3) V6(IO_L17N_VREF_3) V7(IO_L17P_3) V11(IO_L52P_2) V12(IO_L46P_2) V13(IO_L44P_2) V14(IO_L42N_2) V15(IO_L18P_2) V17(IO_L62N_1) V18(IO_L66P_1) V19(IO_L66N_1) V20(IO_L70N_1) V22(IO_L71P_1) W1(IO_L38N_M3DQ3_3) W2(IO_L38P_M3DQ2_3) W3(IO_L42N_GCLK24_M3LDM_3) W5(IO_L22P_3) W7(IO_L15N_3) W8(IO_L15P_3) W9(IO_L19P_3) W11(IO_L52N_2) W12(IO_L46N_2) W14(IO_L44N_2) W16(IO_L18N_2) W22(IO_L71N_1) Y1(IO_L37N_M3DQ1_3) Y3(IO_L37P_M3DQ0_3) Y6(IO_L7N_3) Y8(IO_L9N_3) Y9(IO_L9P_3) Y10(IO_L51P_2) Y18(IO_L6P_2) Y20(IO_L72P_1) Y21(IO_L72N_1) Y22(IO_L73P_1)

### Buses and harness runs
bus DEBUG_LED_[1..4] = port DEBUG_LED_[1..4]
bus IN[0..3] = port IN[0..3]
bus OUT[0..3] = port OUT[0..3]
bus PROM_D[0..7] = port PROM_D[0..7]
bus SD_D[0..3]

### Notes on the sheet
- (near R62) UG380 p.55
  CLK is 50Ω transmission line
  Terminate with 100Ω to VCCO and 100Ω to GND
- (near R62) Place CLK terminations near PROM
- Sheet Name
- Project Title
- Global Project
- Revision
- Size
- Date
- Group
- Sheet
- of
- Filename
- Designers
- (in symbol FPGA_XC6SLX100-3FGG676C, part A) BANK 0
- (in symbol FPGA_XC6SLX100-3FGG676C, part B) BANK 1
- (in symbol FPGA_XC6SLX100-3FGG676C, part C) BANK 2
- (in symbol FPGA_XC6SLX100-3FGG676C, part D) BANK 3
- (in symbol FPGA_XC6SLX100-3FGG676C, part E) BANK 4
- (in symbol FPGA_XC6SLX100-3FGG676C, part F) BANK 5

### Library data of the parts
C149 = CAP_CER: as C100 on sheet FPGA_MISC; Operating Temperature: -55C - 125C; Temperature Coefficient: X7R; ComponentLink1Description: Digikey; ComponentLink1URL: [Digikey Link]; Part#: GCM155R71H104KE02J; ComponentLink2Description: Datasheet; ComponentLink2URL: [Datasheet Link]; Tolerance: 10%; Ratings: AEC-Q200
R58-R62 R64-R69 = RESISTOR: Automotive: AEC-Q200; Operating Temperature: *; # Digikey: *; ComponentLink1Description: Digikey; ComponentLink1URL: *; # Manufacturer: *
R63 = RESISTOR: 1M 0603 1% 1/16W Resistor; Automotive: AEC-Q200; Operating Temperature: *; # Digikey: *; ComponentLink1Description: Digikey; ComponentLink1URL: *; # Manufacturer: *
U4 = FPGA_XC6SLX100-3FGG676C: as U4 on sheet FPGA_MISC; Current: *; Power: *; Mfg: Xilinx; Mfg Part Number: XC6SLX100-3FGG676C; HelpURL: https://www.xilinx.com/support/documentation/data_sheets/ds162.pdf; CreatedBy: Jonathan Bouchard; Temperature: 0°C ~ 85°C (TJ); Value: *; Precision: *; Package: BGA-676; Supplier 1: Digikey; Supplier Part Number 1: 122-1760-ND